# Altium project AMC_FMC_Carrier v4.PrjPcb (part 1 of 17)
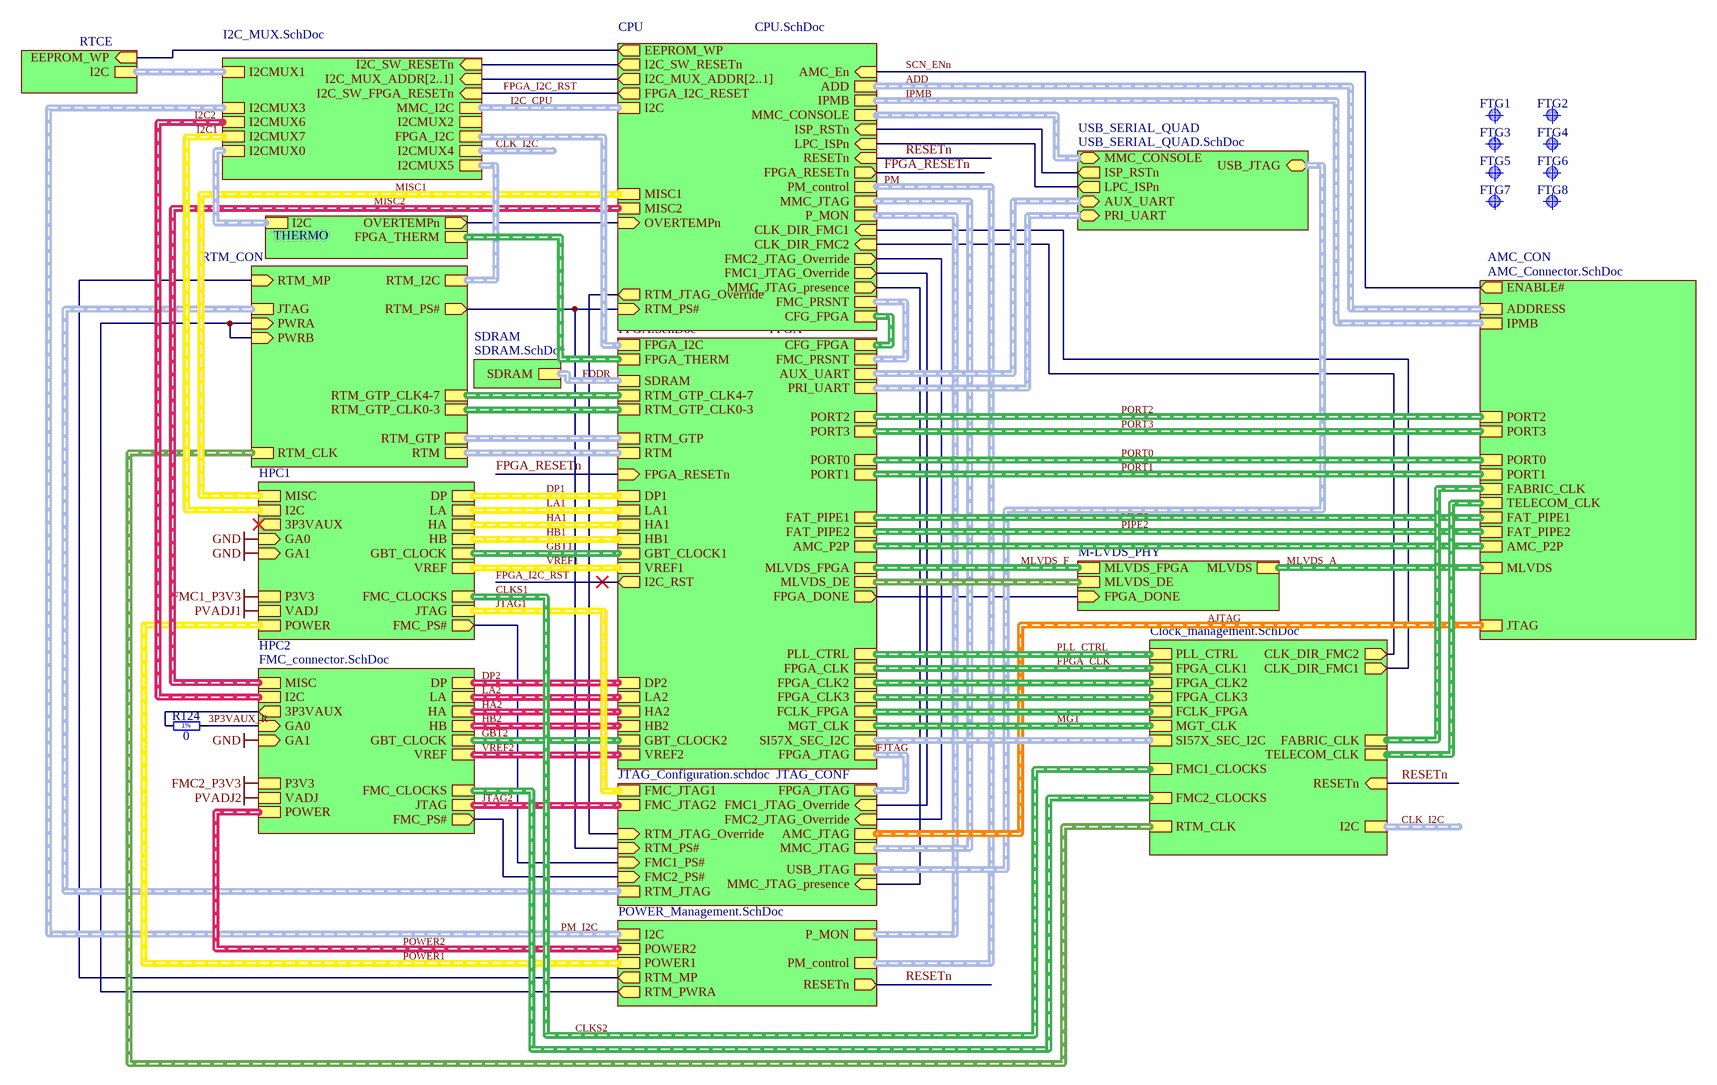
[diagram p0: AMC_FMC_Carrier.SchDoc]
=ModifiedBy: F.Świtakowski
28 sheets, 1702 parts. Net scope: hierarchical (ports join the sheet entries above them; power ports are global).
Board file: AMC_FMC_Carrier_v4.PcbDoc
Sheets:
  AMC_FMC_Carrier.SchDoc
    AMC_CON = AMC_Connector.SchDoc
    HPC1 = FMC_connector.SchDoc
    HPC2 = FMC_connector.SchDoc
    FPGA = FPGA.SchDoc
      FSDRAM = FPGA_SDRAM.SchDoc
      FHPC1 = FMC_HPC1.SchDoc
      FHPC2 = FMC_HPC2_RTM.SchDoc
      FMGT = FPGA_MGT.SchDoc
      FPGA_SUP = FPGA_SUP.SchDoc
    SDRAM = SDRAM.SchDoc
    PWR_MGT = POWER_Management.SchDoc
      SUP_HPC25 = SUP_2.5_FMC.SchDoc
      SUP_HPC33 = SUP_3.3_FMC.SchDoc
      SUP_15 = SUP_1.5_3.3.SchDoc
      SUP_12_18 = SUP_1.2_1.8.SchDoc
      SUP_10 = SUP_1V.SchDoc
      UI = UI_mon.SchDoc
    JTAG_CONF = JTAG_Configuration.SchDoc
    RTM_CON = RTM_CON.SchDoc
    M-LVDS_PHY = M-LVDS PHY.SchDoc
    CLK_MGT = Clock_management.SchDoc
      Oscillators = Oscillators.SchDoc
      Designator = 8V54816A_SUPPLY.SchDoc
    USB_SERIAL_QUAD = USB_SERIAL_QUAD.SchDoc
    I2C_MUX = I2C_MUX.SchDoc
    THERMO = Thermometers.SchDoc
    RTCE = RTCE.SchDoc
    CPU = CPU.SchDoc

## Sheet AMC_FMC_Carrier.SchDoc: AMC FMC Carrier v4
size 420 x 297 mm; Organization: WUT ISE; Address1: Warsaw University of Technology; Address2: Nowowiejska 15/19 00-665 Warsaw; Address3: t.przywozki@gmail.com; DocumentNumber: 1; Revision: 1; SheetNumber: 1; SheetTotal: 29; Project: AMC_FMC_Carrier v4.0.2; ModifiedBy: M. Biernat; CreateDate: XX/XX/XXXX; CheckedDate: -; Title2: Top; DivGrp: ISE; Designer: T.Przywozki

### Parts
FTG1  Use only in PCB  [FIDUCIAL_TOP_S100-200]  (value not drawn)  (no BOM)
FTG2  Use only in PCB  [FIDUCIAL_TOP_C100-200]  (value not drawn)  (no BOM)
FTG3  Use only in PCB  [FIDUCIAL_TOP_S100-200]  (value not drawn)  (no BOM)
FTG4  Use only in PCB  [FIDUCIAL_TOP_C100-200]  (value not drawn)  (no BOM)
FTG5  Use only in PCB  [FIDUCIAL_TOP_S100-200]  (value not drawn)  (no BOM)
FTG6  Use only in PCB  [FIDUCIAL_TOP_C100-200]  (value not drawn)  (no BOM)
FTG7  Use only in PCB  [FIDUCIAL_TOP_S100-200]  (value not drawn)  (no BOM)
FTG8  Use only in PCB  [FIDUCIAL_TOP_C100-200]  (value not drawn)  (no BOM)
R124  0  [RESC1005X40N]

### Sub-sheets
AMC_CON = AMC_Connector.SchDoc: JTAG (harness AMC_JTAG), TELECOM_CLK (harness AMC_TELECOM_CLOCK), ADDRESS (harness AMC_ADD), FABRIC_CLK (harness AMC_FABRIC_CLOCK), IPMB (harness I2C), ENABLE# (out), PORT0 (harness PORT0), PORT1 (harness PORT1), PORT2 (harness PORT2), PORT3 (harness PORT3), FAT_PIPE1 (harness FAT_PIPE1), FAT_PIPE2 (harness FAT_PIPE2), MLVDS (harness MLVDS), AMC_P2P (harness AMC_P2P)
CLK_MGT = Clock_management.SchDoc: FABRIC_CLK (harness AMC_FABRIC_CLOCK), TELECOM_CLK (harness AMC_TELECOM_CLOCK), FMC1_CLOCKS (harness FMC_CLOCKS), FMC2_CLOCKS (harness FMC_CLOCKS), MGT_CLK (harness MGT_CLK), FPGA_CLK1 (harness FPGA_SDRAM_CLK), PLL_CTRL (harness PLL_CTRL), RESETn (in), I2C (harness I2C), SI57X_SEC_I2C (harness SI57X_SEC_I2C), RTM_CLK (harness RTM_CLK), FPGA_CLK2 (harness FPGA_CLK), FPGA_CLK3 (harness FPGA_CLK), CLK_DIR_FMC2 (out), CLK_DIR_FMC1 (out), FCLK_FPGA (harness FPGA_CLK)
CPU = CPU.SchDoc: AMC_En (in), PM_control (harness PM_control), OVERTEMPn (in), CFG_FPGA (harness FPGA_CFG), RESETn (in), I2C (harness I2C), IPMB (harness I2C), MISC1 (harness MISC), MISC2 (harness MISC), ADD (harness AMC_ADD), FPGA_RESETn (out), RTM_PS# (in), I2C_SW_RESETn (out), RTM_JTAG_Override (out), FMC1_JTAG_Override (out), FMC2_JTAG_Override (out), MMC_JTAG (harness JTAG), ISP_RSTn (in), LPC_ISPn (in), MMC_CONSOLE (harness UART), I2C_MUX_ADDR[2..1] (out), P_MON (harness P_MON), EEPROM_WP (out), FMC_PRSNT (harness FMC_PRSNT), FPGA_I2C_RESET (out), CLK_DIR_FMC2 (in), CLK_DIR_FMC1 (in), MMC_JTAG_presence (out)
FPGA = FPGA.SchDoc: SDRAM (harness DDR), FPGA_JTAG (harness JTAG), VREF2 (harness FMC_J1_VREF), VREF1 (harness FMC_J1_VREF), FPGA_THERM (harness FPGA_THERM), CFG_FPGA (harness FPGA_CFG), FAT_PIPE1, FAT_PIPE2, PORT1 (harness PORT1), PORT0 (harness PORT0), MLVDS_FPGA (harness MLVDS-FPGA), GBT_CLOCK1, GBT_CLOCK2, MGT_CLK, FPGA_CLK, PLL_CTRL (harness PLL_CTRL), FPGA_RESETn (in), LA1, HA1, HB1, LA2, HA2, HB2, DP1, DP2, PORT2 (harness PORT2), PORT3 (harness PORT3), RTM_GTP (harness RTM_GTP), RTM_GTP_CLK4-7 (harness CLK_DIFF), RTM_GTP_CLK0-3 (harness CLK_DIFF), AMC_P2P (harness AMC_P2P), FPGA_I2C (harness I2C), SI57X_SEC_I2C (harness SI57X_SEC_I2C), PRI_UART (harness UART), RTM (harness RTM), I2C_RST (out), AUX_UART (harness UART), FPGA_DONE (out), FPGA_CLK2 (harness FPGA_CLK), FPGA_CLK3 (harness FPGA_CLK), FMC_PRSNT (harness FMC_PRSNT), MLVDS_DE (harness MLVDS_DE), FCLK_FPGA (harness FPGA_CLK)
HPC1 = FMC_connector.SchDoc: DP (harness FMC_J1_DP), LA (harness FMC_J1_LA), HA (harness FMC_J1_HA), HB (harness FMC_J1_HB), MISC (harness MISC), POWER (harness FMC_J1_POWER), JTAG (harness JTAG), I2C (harness I2C), GA0 (in), GA1 (in), 3P3VAUX (out), VREF (harness FMC_J1_VREF), FMC_CLOCKS (harness FMC_CLOCKS), GBT_CLOCK (harness GBT_CLOCK), VADJ, P3V3, FMC_PS# (out)
HPC2 = FMC_connector.SchDoc: DP (harness FMC_J1_DP), LA (harness FMC_J1_LA), HA (harness FMC_J1_HA), HB (harness FMC_J1_HB), MISC (harness MISC), POWER (harness FMC_J1_POWER), JTAG (harness JTAG), I2C (harness I2C), VREF (harness FMC_J1_VREF), GA0 (in), GA1 (in), 3P3VAUX (out), FMC_CLOCKS (harness FMC_CLOCKS), GBT_CLOCK (harness GBT_CLOCK), VADJ, P3V3, FMC_PS# (out)
I2C_MUX = I2C_MUX.SchDoc: I2CMUX0 (harness I2C), I2CMUX1 (harness I2C), I2CMUX3 (harness I2C), I2CMUX4 (harness I2C), I2C_SW_RESETn (in), MMC_I2C (harness I2C), I2CMUX7 (harness I2C), I2CMUX6 (harness I2C), I2CMUX5 (harness I2C), FPGA_I2C (harness I2C), I2C_MUX_ADDR[2..1] (in), I2C_SW_FPGA_RESETn (in), I2CMUX2 (harness I2C)
JTAG_CONF = JTAG_Configuration.schdoc: FMC_JTAG1 (harness JTAG), FMC_JTAG2 (harness JTAG), AMC_JTAG (harness AMC_JTAG), FPGA_JTAG (harness JTAG), RTM_JTAG (harness JTAG), FMC1_PS# (in), FMC2_PS# (in), MMC_JTAG (harness JTAG), USB_JTAG (harness USB_JTAG), RTM_PS# (in), RTM_JTAG_Override (in), FMC2_JTAG_Override (in), FMC1_JTAG_Override (in), MMC_JTAG_presence (in)
M-LVDS_PHY = M-LVDS PHY.SchDoc: MLVDS (harness MLVDS), MLVDS_FPGA (harness MLVDS-FPGA), FPGA_DONE (in), MLVDS_DE (harness MLVDS_DE)
PWR_MGT = POWER_Management.SchDoc: POWER1 (harness FMC_J1_POWER), POWER2 (harness FMC_J1_POWER), PM_control (harness PM_control), RESETn (out), I2C (harness I2C), RTM_MP (out), RTM_PWRA (out), P_MON (harness P_MON)
RTCE = RTCE.SchDoc: I2C (harness I2C), EEPROM_WP (in)
RTM_CON = RTM_CON.SchDoc: PWRA (in), PWRB (in), RTM_PS# (out), RTM_MP (in), RTM_GTP (harness RTM_GTP), JTAG (harness JTAG), RTM_GTP_CLK4-7 (harness CLK_DIFF), RTM_GTP_CLK0-3 (harness CLK_DIFF), RTM_CLK (harness RTM_CLK), RTM (harness RTM), RTM_I2C (harness I2C)
SDRAM = SDRAM.SchDoc: SDRAM (harness DDR)
THERMO = Thermometers.SchDoc: OVERTEMPn (out), FPGA_THERM (harness FPGA_THERM), I2C (harness I2C)
USB_SERIAL_QUAD = USB_SERIAL_QUAD.SchDoc: PRI_UART (bidir, harness UART), AUX_UART (bidir, harness UART), ISP_RSTn (out), LPC_ISPn (out), MMC_CONSOLE (bidir, harness UART), USB_JTAG (bidir, harness USB_JTAG)

### Nets
FMC2_3P3VAUX: R124.1 ; sheet HPC2/3P3VAUX
GND: sheet HPC1/GA0, sheet HPC1/GA1, sheet HPC2/GA1
3P3VAUX_R: R124.2 ; sheet HPC2/GA0
CLK_DIR: sheet CLK_MGT/CLK_DIR_FMC2, sheet CPU/CLK_DIR_FMC2
CLKS1.CLK_DIR: sheet CLK_MGT/CLK_DIR_FMC1, sheet CPU/CLK_DIR_FMC1
DONE: sheet FPGA/FPGA_DONE, sheet M-LVDS_PHY/FPGA_DONE
DTR: sheet USB_SERIAL_QUAD/ISP_RSTn, sheet CPU/ISP_RSTn
EEPROM_WP: sheet RTCE/EEPROM_WP, sheet CPU/EEPROM_WP
FMC1_JTAG_Override: sheet JTAG_CONF/FMC1_JTAG_Override, sheet CPU/FMC1_JTAG_Override
FMC2_JTAG_Override: sheet JTAG_CONF/FMC2_JTAG_Override, sheet CPU/FMC2_JTAG_Override
FMC_PRSNT.FMC1_PRSNT_M2C_L: sheet HPC1/FMC_PS#, sheet JTAG_CONF/FMC1_PS#
FMC_PRSNT.FMC2_PRSNT_M2C_L: sheet HPC2/FMC_PS#, sheet JTAG_CONF/FMC2_PS#
FPGA_I2C_RST: sheet FPGA/I2C_RST, sheet I2C_MUX/I2C_SW_FPGA_RESETn, sheet CPU/FPGA_I2C_RESET
FPGA_RESETn: sheet FPGA/FPGA_RESETn, sheet CPU/FPGA_RESETn
I2C_SW_RESETn: sheet I2C_MUX/I2C_SW_RESETn, sheet CPU/I2C_SW_RESETn
LPC_ISPn: sheet USB_SERIAL_QUAD/LPC_ISPn, sheet CPU/LPC_ISPn
MMC_JTAG_presence: sheet JTAG_CONF/MMC_JTAG_presence, sheet CPU/MMC_JTAG_presence
OVERTEMPn: sheet THERMO/OVERTEMPn, sheet CPU/OVERTEMPn
PWRA: sheet PWR_MGT/RTM_PWRA, sheet RTM_CON/PWRA, sheet RTM_CON/PWRB
RESETn: sheet PWR_MGT/RESETn, sheet CLK_MGT/RESETn, sheet CPU/RESETn
RTM_JTAG_Override: sheet JTAG_CONF/RTM_JTAG_Override, sheet CPU/RTM_JTAG_Override
RTM_MP: sheet PWR_MGT/RTM_MP, sheet RTM_CON/RTM_MP
RTM_PS#: sheet JTAG_CONF/RTM_PS#, sheet RTM_CON/RTM_PS#, sheet CPU/RTM_PS#
SCN_ENn: sheet AMC_CON/ENABLE#, sheet CPU/AMC_En

### Buses and harness runs
bus sheet CPU/I2C_MUX_ADDR[2..1] = sheet I2C_MUX/I2C_MUX_ADDR[2..1]
harness ADD = sheet AMC_CON/ADDRESS = sheet CPU/ADD
harness AJTAG = sheet AMC_CON/JTAG = sheet JTAG_CONF/AMC_JTAG
harness CLK_I2C = sheet CLK_MGT/I2C
harness CLK_I2C = sheet I2C_MUX/I2CMUX4
harness CLKS1 = CLKS2 = sheet CLK_MGT/FMC1_CLOCKS = sheet HPC1/FMC_CLOCKS
harness DP1 = sheet FPGA/DP1 = sheet HPC1/DP
harness DP2 = sheet FPGA/DP2 = sheet HPC2/DP
harness FDDR = sheet FPGA/SDRAM = sheet SDRAM/SDRAM
harness FJTAG = sheet FPGA/FPGA_JTAG = sheet JTAG_CONF/FPGA_JTAG
harness FPGA_CLK = sheet CLK_MGT/FPGA_CLK1 = sheet FPGA/FPGA_CLK
harness GBT1 = sheet FPGA/GBT_CLOCK1 = sheet HPC1/GBT_CLOCK
harness GBT2 = sheet FPGA/GBT_CLOCK2 = sheet HPC2/GBT_CLOCK
harness HA1 = sheet FPGA/HA1 = sheet HPC1/HA
harness HA2 = sheet FPGA/HA2 = sheet HPC2/HA
harness HB1 = sheet FPGA/HB1 = sheet HPC1/HB
harness HB2 = sheet FPGA/HB2 = sheet HPC2/HB
harness I2C1 = sheet HPC1/I2C = sheet I2C_MUX/I2CMUX7
harness I2C2 = sheet HPC2/I2C = sheet I2C_MUX/I2CMUX6
harness I2C_CPU = sheet CPU/I2C = sheet I2C_MUX/MMC_I2C
harness IPMB = sheet AMC_CON/IPMB = sheet CPU/IPMB
harness JTAG1 = sheet HPC1/JTAG = sheet JTAG_CONF/FMC_JTAG1
harness JTAG2 = sheet HPC2/JTAG = sheet JTAG_CONF/FMC_JTAG2
harness LA1 = sheet FPGA/LA1 = sheet HPC1/LA
harness LA2 = sheet FPGA/LA2 = sheet HPC2/LA
harness MGT = sheet CLK_MGT/MGT_CLK = sheet FPGA/MGT_CLK
harness MISC1 = sheet CPU/MISC1 = sheet HPC1/MISC
harness MISC2 = sheet CPU/MISC2 = sheet HPC2/MISC
harness MLVDS_A = sheet AMC_CON/MLVDS = sheet M-LVDS_PHY/MLVDS
harness MLVDS_F = sheet FPGA/MLVDS_FPGA = sheet M-LVDS_PHY/MLVDS_FPGA
harness PIPE1 = sheet AMC_CON/FAT_PIPE1 = sheet FPGA/FAT_PIPE1
harness PIPE2 = sheet AMC_CON/FAT_PIPE2 = sheet FPGA/FAT_PIPE2
harness PLL_CTRL = sheet CLK_MGT/PLL_CTRL = sheet FPGA/PLL_CTRL
harness PM = sheet CPU/PM_control = sheet PWR_MGT/PM_control
harness PM_I2C = sheet I2C_MUX/I2CMUX3 = sheet PWR_MGT/I2C
harness PORT0 = sheet AMC_CON/PORT0 = sheet FPGA/PORT0
harness PORT1 = sheet AMC_CON/PORT1 = sheet FPGA/PORT1
harness PORT2 = sheet AMC_CON/PORT2 = sheet FPGA/PORT2
harness PORT3 = sheet AMC_CON/PORT3 = sheet FPGA/PORT3
harness POWER1 = sheet HPC1/POWER = sheet PWR_MGT/POWER1
harness POWER2 = sheet HPC2/POWER = sheet PWR_MGT/POWER2
harness sheet AMC_CON/AMC_P2P = sheet FPGA/AMC_P2P
harness sheet AMC_CON/FABRIC_CLK = sheet CLK_MGT/FABRIC_CLK
harness sheet AMC_CON/TELECOM_CLK = sheet CLK_MGT/TELECOM_CLK
harness sheet CLK_MGT/FCLK_FPGA = sheet FPGA/FCLK_FPGA
harness sheet CLK_MGT/FMC2_CLOCKS = sheet HPC2/FMC_CLOCKS
harness sheet CLK_MGT/FPGA_CLK2 = sheet FPGA/FPGA_CLK2
harness sheet CLK_MGT/FPGA_CLK3 = sheet FPGA/FPGA_CLK3
harness sheet CLK_MGT/RTM_CLK = sheet RTM_CON/RTM_CLK
harness sheet CLK_MGT/SI57X_SEC_I2C = sheet FPGA/SI57X_SEC_I2C
harness sheet CPU/CFG_FPGA = sheet FPGA/CFG_FPGA
harness sheet CPU/FMC_PRSNT = sheet FPGA/FMC_PRSNT
harness sheet CPU/MMC_CONSOLE = sheet USB_SERIAL_QUAD/MMC_CONSOLE
harness sheet CPU/MMC_JTAG = sheet JTAG_CONF/MMC_JTAG
harness sheet CPU/P_MON = sheet PWR_MGT/P_MON
harness sheet FPGA/AUX_UART = sheet USB_SERIAL_QUAD/AUX_UART
harness sheet FPGA/FPGA_I2C = sheet I2C_MUX/FPGA_I2C
harness sheet FPGA/FPGA_THERM = sheet THERMO/FPGA_THERM
harness sheet FPGA/MLVDS_DE = sheet M-LVDS_PHY/MLVDS_DE
harness sheet FPGA/PRI_UART = sheet USB_SERIAL_QUAD/PRI_UART
harness sheet FPGA/RTM = sheet RTM_CON/RTM
harness sheet FPGA/RTM_GTP = sheet RTM_CON/RTM_GTP
harness sheet FPGA/RTM_GTP_CLK0-3 = sheet RTM_CON/RTM_GTP_CLK0-3
harness sheet FPGA/RTM_GTP_CLK4-7 = sheet RTM_CON/RTM_GTP_CLK4-7
harness sheet I2C_MUX/I2CMUX0 = sheet THERMO/I2C
harness sheet I2C_MUX/I2CMUX1 = sheet RTCE/I2C
harness sheet I2C_MUX/I2CMUX5 = sheet RTM_CON/RTM_I2C
harness sheet JTAG_CONF/RTM_JTAG = sheet RTM_CON/JTAG
harness sheet JTAG_CONF/USB_JTAG = sheet USB_SERIAL_QUAD/USB_JTAG
harness VREF1 = sheet FPGA/VREF1 = sheet HPC1/VREF
harness VREF2 = sheet FPGA/VREF2 = sheet HPC2/VREF

### Notes on the sheet
- Project/Equipment
- Document
- Designer
- Drawn by
- Check.by
- Copyright CNPEM 2013, WUT ISE 2020
  This documentation describes Open Hardware and is licensed under CERN OHL v.1.1. You may redistribute and modify this documentaction under the terms of the CERN OHL v1.1.
  (http://ohwr.org/CERNOHL). This documentation is dristributed WITHOUT ANY EXPRESS OR IMPLIED WARRANTY, INCLUDING OF MERCHANTABLITY, SATISFACTORY QUALITY AND FITNESS FOR A PARTICULAR PURPOSE. Please see the CERN OHL v.1.1 for applicable conditions
- File
- Last Mod.
- Print Date
- Sheet
- Size
- A3
- of
- Rev
- Contact:
- (in symbol R0402_0R_JUMPER) 1%

### Library data of the parts
FTG1 FTG3 FTG5 FTG7 = FIDUCIAL_TARGET_S100-200: Fiducial Target; Part Description: Square Fiducial Target, Top Layer, 1.0mm, Top Solder 2.0mm, Keepout =2.0mm; Mounted: No; Table: Pads; Part Number: FIDUCIAL_TARGET_S100-200; Component Type: Standard (No BOM); Pin Count: 1; Family: Fiducial; Socket: No; SMD: Yes; Status: None; ComponentHeight: 0mm; Author: CERN DEM JLC; CreateDate: 2010-02-09; LatestRevisionDate: 2012-04-04; PackageDescription: Square Fiducial Target, Top Layer, 1.0mm, Top Solder 2.0mm, Keepout =2.0mm
FTG2 FTG4 FTG6 FTG8 = FIDUCIAL_TARGET_C100-200: Fiducial Target; Part Description: Round Fiducial Target, Top Layer, 1.0mm, Top Solder 2.0mm, Keepout =2.0mm; Mounted: No; Table: Pads; Part Number: FIDUCIAL_TARGET_C100-200; Component Type: Standard (No BOM); Pin Count: 1; Family: Fiducial; Socket: No; SMD: Yes; Status: None; ComponentHeight: 0mm; Author: CERN DEM JLC; CreateDate: 2010-02-09; LatestRevisionDate: 2012-04-04; PackageDescription: Round Fiducial Target, Top Layer, 1.0mm, Top Solder 2.0mm, Keepout =2.0mm
R124 = R0402_0R_JUMPER: Resistor - 1%; Part Description: 1A (0.05R Max DC Resistance) Zero Ohm Jumper; Manufacturer: GENERIC; Manufacturer1 Part Number: 232270591001L; Table: Resistors SMD; Part Number: R0402_0R_JUMPER; Component Kind: Standard; Component Type: Standard; Pin Count: 2; Value: 0; Status: Not recommended; Manufacturer Part Number: R0402_0R_JUMPER; Case: 0402; Mounted: Yes; Socket: No; SMD: Yes; Manufacturer1 Example: YAGEO PHYCOMP; Manufacturer1 ComponentHeight: 0.4mm; HelpURL: \\cern.ch\dfs\Applications\Altium\Datasheets\R0402_Phycomp_RC0402.pdf; Author: CERN DEM JLC; CreateDate: 2007-12-03; LatestRevisionDate: 2012-10-17

## Sheet AMC_Connector.SchDoc: AMC FMC Carrier v4.0.5
size 420 x 297 mm; DocumentNumber: 1; Revision: 1; SheetNumber: 2; SheetTotal: 29; Organization: ISE; Address1: Warsaw University of Technology; Address2: Nowowiejska 15/19 00-665 Warsaw; Address3: t.przywozki@gmail.com; ModifiedBy: F. Świtakowski; CheckedDate: -; Title2: AMC connector; DivGrp: ISE; Designer: T.Przywozki; Project: AMC FMC Carrier v4.0.5
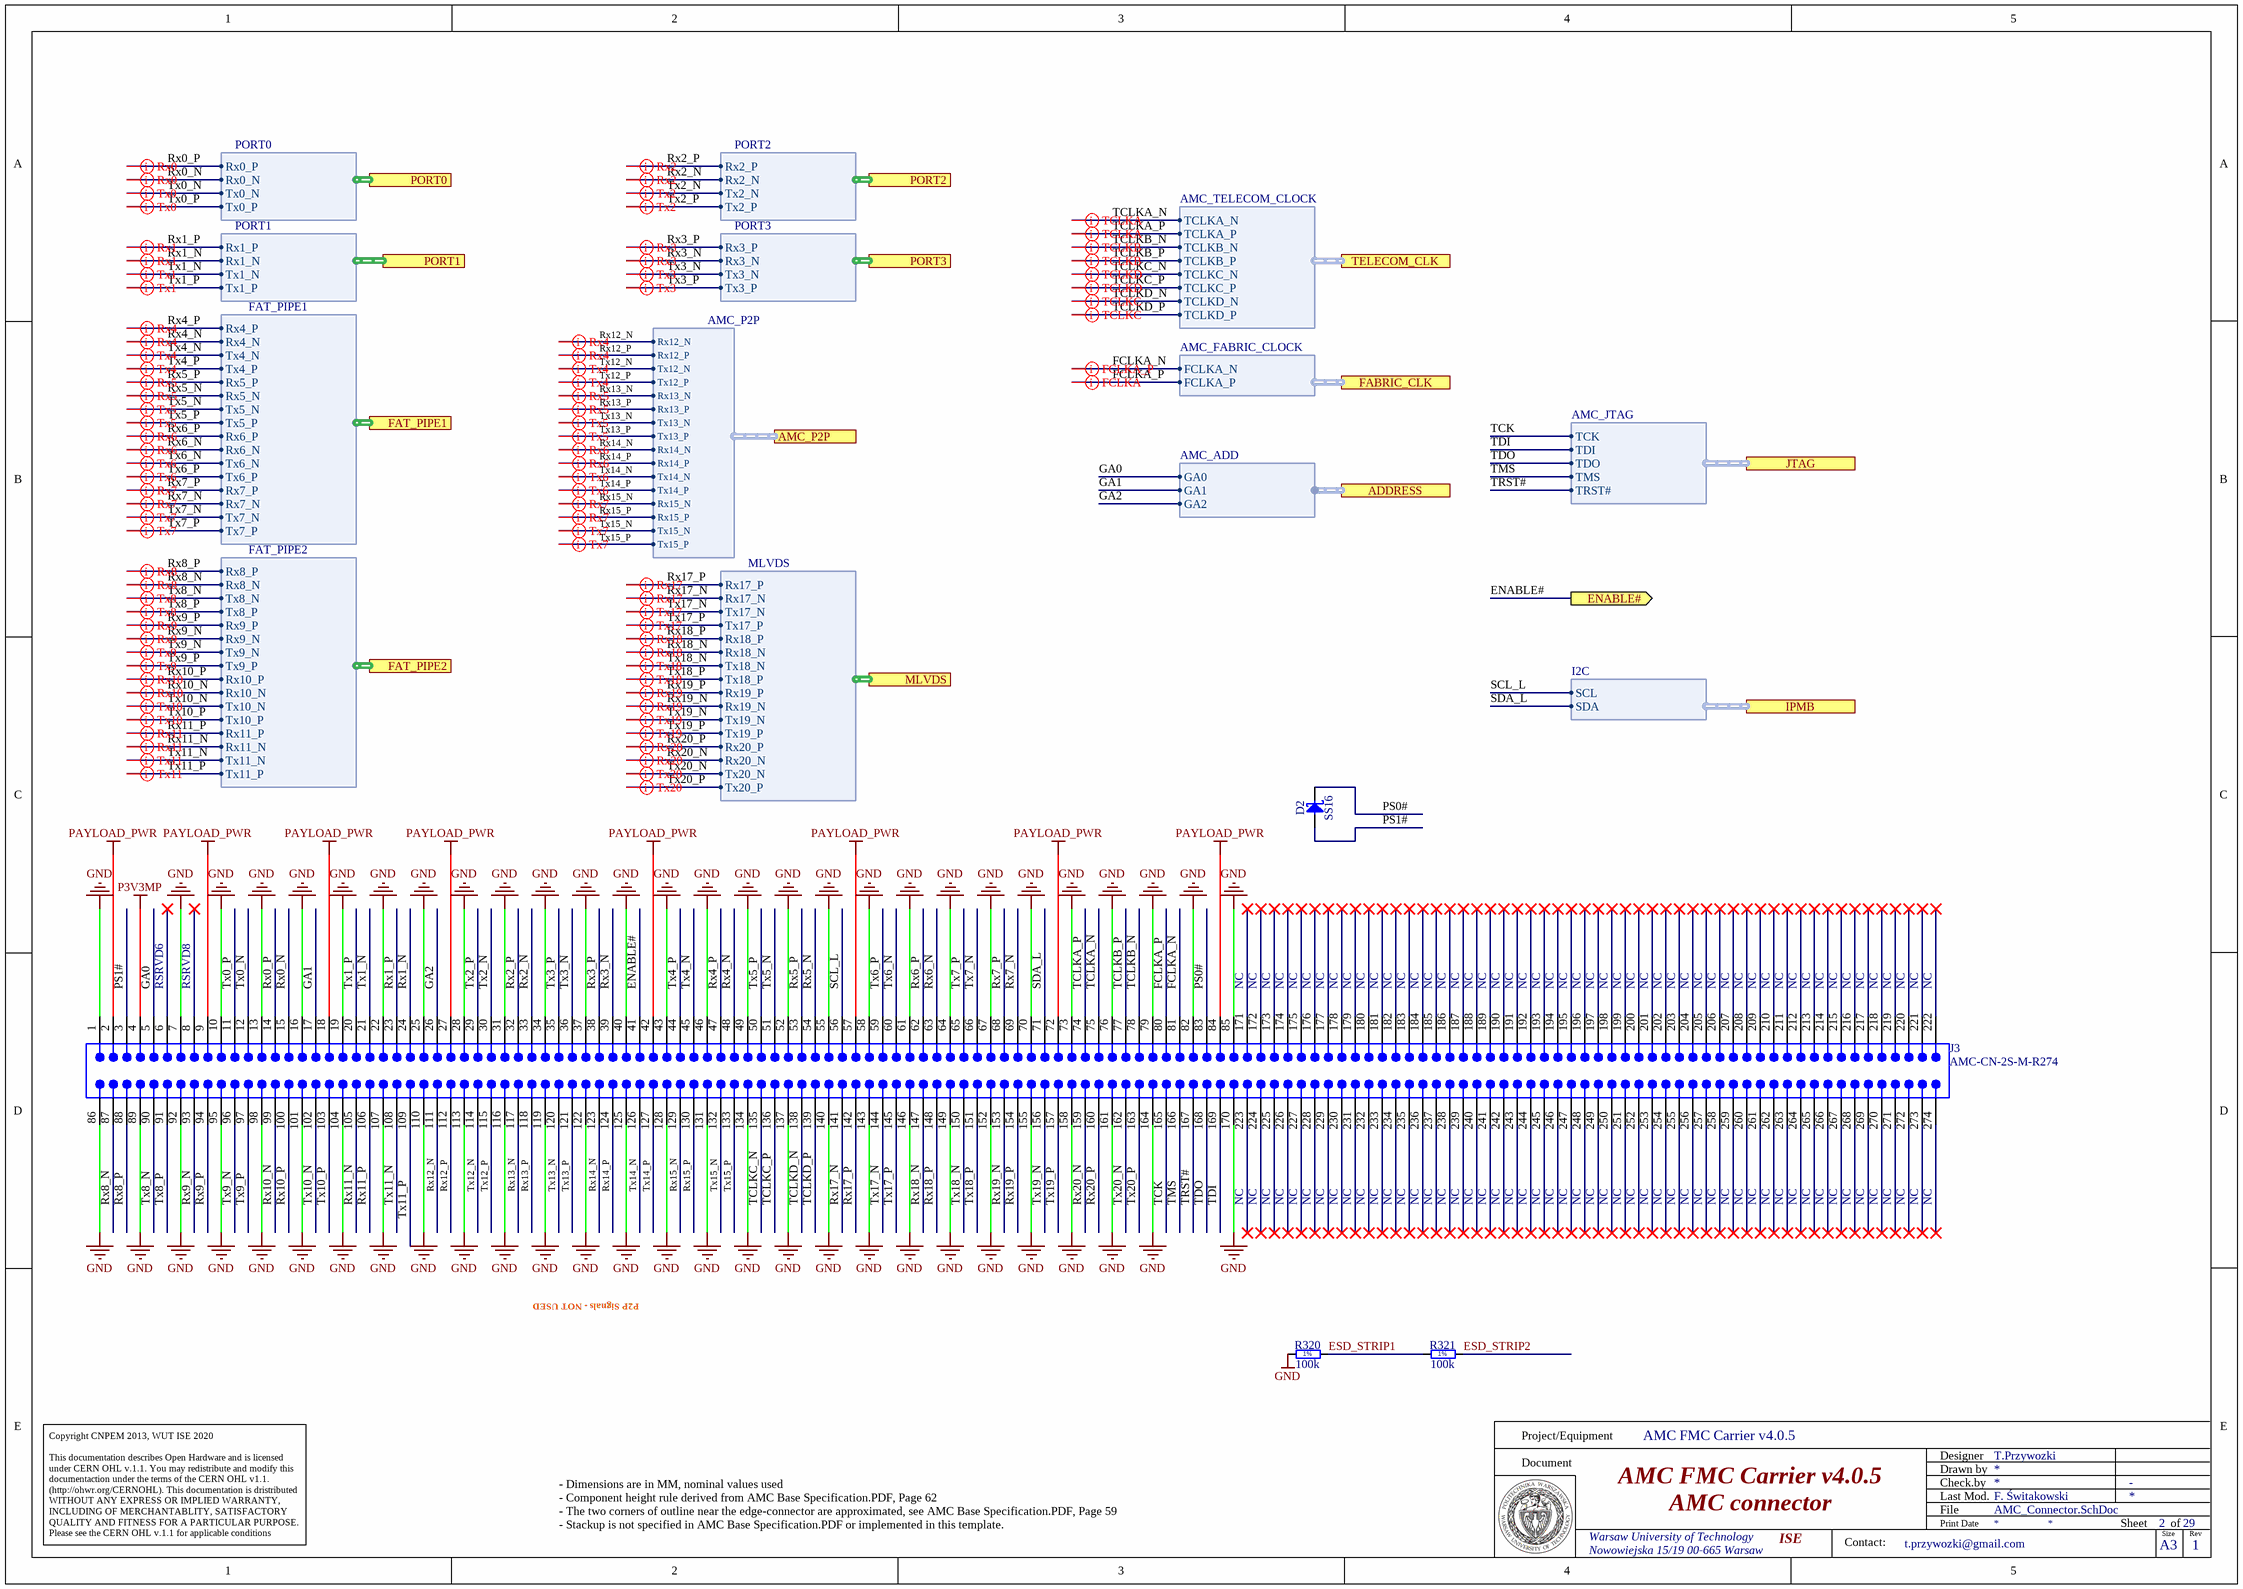
[diagram p1: AMC_Connector.SchDoc]

### Parts
D2  SS16  [DIOM5127X229N]
J3  AMC-CN-2S-M-R274  [AMC-GF-2D-750-O274]  (no BOM)
R320  100k  [RESC3216X65N]
R321  100k  [RESC3216X65N]

### Ports
ADDRESS (harness AMC_ADD), AMC_P2P (harness AMC_P2P), ENABLE# (out), FABRIC_CLK (harness AMC_FABRIC_CLOCK), FAT_PIPE1 (harness FAT_PIPE1), FAT_PIPE2 (harness FAT_PIPE2), IPMB (harness I2C), JTAG (harness AMC_JTAG), MLVDS (harness MLVDS), PORT0 (harness PORT0), PORT1 (harness PORT1), PORT2 (harness PORT2), PORT3 (harness PORT3), TELECOM_CLK (harness AMC_TELECOM_CLOCK)

### Harnesses
AMC_JTAG: TCK, TDI, TDO, TMS, TRST#
AMC_TELECOM_CLOCK: TCLKA_N, TCLKA_P, TCLKB_N, TCLKB_P, TCLKC_N, TCLKC_P, TCLKD_N, TCLKD_P
AMC_FABRIC_CLOCK: FCLKA_N, FCLKA_P
I2C: SCL, SDA
PORT0: Rx0_P, Rx0_N, Tx0_N, Tx0_P
PORT1: Rx1_P, Rx1_N, Tx1_N, Tx1_P
FAT_PIPE1: Rx4_P, Rx4_N, Tx4_N, Tx4_P, Rx5_P, Rx5_N, Tx5_N, Tx5_P, Rx6_P, Rx6_N, Tx6_N, Tx6_P, Rx7_P, Rx7_N, Tx7_N, Tx7_P
FAT_PIPE2: Rx8_P, Rx8_N, Tx8_N, Tx8_P, Rx9_P, Rx9_N, Tx9_N, Tx9_P, Rx10_P, Rx10_N, Tx10_N, Tx10_P, Rx11_P, Rx11_N, Tx11_N, Tx11_P
MLVDS: Rx17_P, Rx17_N, Tx17_N, Tx17_P, Rx18_P, Rx18_N, Tx18_N, Tx18_P, Rx19_P, Rx19_N, Tx19_N, Tx19_P, Rx20_P, Rx20_N, Tx20_N, Tx20_P
PORT2: Rx2_P, Rx2_N, Tx2_N, Tx2_P
PORT3: Rx3_P, Rx3_N, Tx3_N, Tx3_P
AMC_ADD: GA0, GA1, GA2
AMC_P2P: Rx12_N, Rx12_P, Tx12_N, Tx12_P, Rx13_N, Rx13_P, Tx13_N, Tx13_P, Rx14_N, Rx14_P, Tx14_N, Tx14_P, Rx15_N, Rx15_P, Tx15_N, Tx15_P

### Nets
GND: J3.1 J3.7 J3.10 J3.13 J3.16 J3.19 J3.22 J3.25 J3.28 J3.31 J3.34 J3.37 J3.40 J3.43 J3.46 J3.49 J3.52 J3.55 J3.58 J3.61 J3.64 J3.67 J3.70 J3.73 J3.76 J3.79 J3.82 J3.85 J3.86 J3.89 J3.92 J3.95 J3.98 J3.101 J3.104 J3.107 J3.110 J3.113 J3.116 J3.119 J3.122 J3.125 J3.128 J3.131 J3.134 J3.137 J3.140 J3.143 J3.146 J3.149 J3.152 J3.155 J3.158 J3.161 J3.164 J3.170 R320.1
P3V3MP: J3.4
PAYLOAD_PWR: J3.2 J3.9 J3.18 J3.27 J3.42 J3.57 J3.72 J3.84
ENABLE#: J3.41 ; port ENABLE#  [project net SCN_ENn]
ESD_STRIP1: R320.2 R321.1
ESD_STRIP2: R321.2
FCLKA_N: J3.81 ; port FABRIC_CLK.FCLKA_N  [project net MGT.FCLK_GTP216_CLK0_N]
FCLKA_P: J3.80 ; port FABRIC_CLK.FCLKA_P  [project net MGT.FCLK_GTP216_CLK0_P]
GA0: J3.5 ; port ADDRESS.GA0  [project net ADD.GA0]
GA1: J3.17 ; port ADDRESS.GA1  [project net ADD.GA1]
GA2: J3.26 ; port ADDRESS.GA2  [project net ADD.GA2]
PS0#: D2.1(C) J3.83
PS1#: D2.2(A) J3.3
Rx0_N: J3.15 ; port PORT0.Rx0_N  [project net PORT0.Rx0_N]
Rx0_P: J3.14 ; port PORT0.Rx0_P  [project net PORT0.Rx0_P]
Rx1_N: J3.24 ; port PORT1.Rx1_N  [project net PORT1.Rx1_N]
Rx1_P: J3.23 ; port PORT1.Rx1_P  [project net PORT1.Rx1_P]
Rx2_N: J3.33 ; port PORT2.Rx2_N  [project net PORT2.Rx2_N]
Rx2_P: J3.32 ; port PORT2.Rx2_P  [project net PORT2.Rx2_P]
Rx3_N: J3.39 ; port PORT3.Rx3_N  [project net PORT3.Rx3_N]
Rx3_P: J3.38 ; port PORT3.Rx3_P  [project net PORT3.Rx3_P]
Rx4_N: J3.48 ; port FAT_PIPE1.Rx4_N  [project net PIPE1.Rx4_N]
Rx4_P: J3.47 ; port FAT_PIPE1.Rx4_P  [project net PIPE1.Rx4_P]
Rx5_N: J3.54 ; port FAT_PIPE1.Rx5_N  [project net PIPE1.Rx5_N]
Rx5_P: J3.53 ; port FAT_PIPE1.Rx5_P  [project net PIPE1.Rx5_P]
Rx6_N: J3.63 ; port FAT_PIPE1.Rx6_N  [project net PIPE1.Rx6_N]
Rx6_P: J3.62 ; port FAT_PIPE1.Rx6_P  [project net PIPE1.Rx6_P]
Rx7_N: J3.69 ; port FAT_PIPE1.Rx7_N  [project net PIPE1.Rx7_N]
Rx7_P: J3.68 ; port FAT_PIPE1.Rx7_P  [project net PIPE1.Rx7_P]
Rx8_N: J3.87 ; port FAT_PIPE2.Rx8_N  [project net PIPE2.Rx8_N]
Rx8_P: J3.88 ; port FAT_PIPE2.Rx8_P  [project net PIPE2.Rx8_P]
Rx9_N: J3.93 ; port FAT_PIPE2.Rx9_N  [project net PIPE2.Rx9_N]
Rx9_P: J3.94 ; port FAT_PIPE2.Rx9_P  [project net PIPE2.Rx9_P]
Rx10_N: J3.99 ; port FAT_PIPE2.Rx10_N  [project net PIPE2.Rx10_N]
Rx10_P: J3.100 ; port FAT_PIPE2.Rx10_P  [project net PIPE2.Rx10_P]
Rx11_N: J3.105 ; port FAT_PIPE2.Rx11_N  [project net PIPE2.Rx11_N]
Rx11_P: J3.106 ; port FAT_PIPE2.Rx11_P  [project net PIPE2.Rx11_P]
Rx12_N: J3.111 ; port AMC_P2P.Rx12_N
Rx12_P: J3.112 ; port AMC_P2P.Rx12_P
Rx13_N: J3.117 ; port AMC_P2P.Rx13_N
Rx13_P: J3.118 ; port AMC_P2P.Rx13_P
Rx14_N: J3.123 ; port AMC_P2P.Rx14_N
Rx14_P: J3.124 ; port AMC_P2P.Rx14_P
Rx15_N: J3.129 ; port AMC_P2P.Rx15_N
Rx15_P: J3.130 ; port AMC_P2P.Rx15_P
Rx17_N: J3.141 ; port MLVDS.Rx17_N  [project net MLVDS_A.Rx17_N]
Rx17_P: J3.142 ; port MLVDS.Rx17_P  [project net MLVDS_A.Rx17_P]
Rx18_N: J3.147 ; port MLVDS.Rx18_N  [project net MLVDS_A.Rx18_N]
Rx18_P: J3.148 ; port MLVDS.Rx18_P  [project net MLVDS_A.Rx18_P]
Rx19_N: J3.153 ; port MLVDS.Rx19_N  [project net MLVDS_A.Rx19_N]
Rx19_P: J3.154 ; port MLVDS.Rx19_P  [project net MLVDS_A.Rx19_P]
Rx20_N: J3.159 ; port MLVDS.Rx20_N  [project net MLVDS_A.Rx20_N]
Rx20_P: J3.160 ; port MLVDS.Rx20_P  [project net MLVDS_A.Rx20_P]
SCL_L: J3.56 ; port IPMB.SCL  [project net IPMB.SCL]
SDA_L: J3.71 ; port IPMB.SDA  [project net IPMB.SDA]
TCK: J3.165 ; port JTAG.TCK  [project net AJTAG.TCK]
TCLKA_N: J3.75 ; port TELECOM_CLK.TCLKA_N
TCLKA_P: J3.74 ; port TELECOM_CLK.TCLKA_P
TCLKB_N: J3.78 ; port TELECOM_CLK.TCLKB_N
TCLKB_P: J3.77 ; port TELECOM_CLK.TCLKB_P
TCLKC_N: J3.135 ; port TELECOM_CLK.TCLKC_N
TCLKC_P: J3.136 ; port TELECOM_CLK.TCLKC_P
TCLKD_N: J3.138 ; port TELECOM_CLK.TCLKD_N
TCLKD_P: J3.139 ; port TELECOM_CLK.TCLKD_P
TDI: J3.169 ; port JTAG.TDI  [project net AJTAG.TDI]
TDO: J3.168 ; port JTAG.TDO  [project net AJTAG.TDO]
TMS: J3.166 ; port JTAG.TMS  [project net AJTAG.TMS]
TRST#: J3.167 ; port JTAG.TRST#  [project net AJTAG.TRST#]
Tx0_N: J3.12 ; port PORT0.Tx0_N  [project net PORT0.Tx0_N]
Tx0_P: J3.11 ; port PORT0.Tx0_P  [project net PORT0.Tx0_P]
Tx1_N: J3.21 ; port PORT1.Tx1_N  [project net PORT1.Tx1_N]
Tx1_P: J3.20 ; port PORT1.Tx1_P  [project net PORT1.Tx1_P]
Tx2_N: J3.30 ; port PORT2.Tx2_N  [project net PORT2.Tx2_N]
Tx2_P: J3.29 ; port PORT2.Tx2_P  [project net PORT2.Tx2_P]
Tx3_N: J3.36 ; port PORT3.Tx3_N  [project net PORT3.Tx3_N]
Tx3_P: J3.35 ; port PORT3.Tx3_P  [project net PORT3.Tx3_P]
Tx4_N: J3.45 ; port FAT_PIPE1.Tx4_N  [project net PIPE1.Tx4_N]
Tx4_P: J3.44 ; port FAT_PIPE1.Tx4_P  [project net PIPE1.Tx4_P]
Tx5_N: J3.51 ; port FAT_PIPE1.Tx5_N  [project net PIPE1.Tx5_N]
Tx5_P: J3.50 ; port FAT_PIPE1.Tx5_P  [project net PIPE1.Tx5_P]
Tx6_N: J3.60 ; port FAT_PIPE1.Tx6_N  [project net PIPE1.Tx6_N]
Tx6_P: J3.59 ; port FAT_PIPE1.Tx6_P  [project net PIPE1.Tx6_P]
Tx7_N: J3.66 ; port FAT_PIPE1.Tx7_N  [project net PIPE1.Tx7_N]
Tx7_P: J3.65 ; port FAT_PIPE1.Tx7_P  [project net PIPE1.Tx7_P]
Tx8_N: J3.90 ; port FAT_PIPE2.Tx8_N  [project net PIPE2.Tx8_N]
Tx8_P: J3.91 ; port FAT_PIPE2.Tx8_P  [project net PIPE2.Tx8_P]
Tx9_N: J3.96 ; port FAT_PIPE2.Tx9_N  [project net PIPE2.Tx9_N]
Tx9_P: J3.97 ; port FAT_PIPE2.Tx9_P  [project net PIPE2.Tx9_P]
Tx10_N: J3.102 ; port FAT_PIPE2.Tx10_N  [project net PIPE2.Tx10_N]
Tx10_P: J3.103 ; port FAT_PIPE2.Tx10_P  [project net PIPE2.Tx10_P]
Tx11_N: J3.108 ; port FAT_PIPE2.Tx11_N  [project net PIPE2.Tx11_N]
Tx11_P: J3.109 ; port FAT_PIPE2.Tx11_P  [project net PIPE2.Tx11_P]
Tx12_N: J3.114 ; port AMC_P2P.Tx12_N
Tx12_P: J3.115 ; port AMC_P2P.Tx12_P
Tx13_N: J3.120 ; port AMC_P2P.Tx13_N
Tx13_P: J3.121 ; port AMC_P2P.Tx13_P
Tx14_N: J3.126 ; port AMC_P2P.Tx14_N
Tx14_P: J3.127 ; port AMC_P2P.Tx14_P
Tx15_N: J3.132 ; port AMC_P2P.Tx15_N
Tx15_P: J3.133 ; port AMC_P2P.Tx15_P
Tx17_N: J3.144 ; port MLVDS.Tx17_N  [project net MLVDS_A.Tx17_N]
Tx17_P: J3.145 ; port MLVDS.Tx17_P  [project net MLVDS_A.Tx17_P]
Tx18_N: J3.150 ; port MLVDS.Tx18_N  [project net MLVDS_A.Tx18_N]
Tx18_P: J3.151 ; port MLVDS.Tx18_P  [project net MLVDS_A.Tx18_P]
Tx19_N: J3.156 ; port MLVDS.Tx19_N  [project net MLVDS_A.Tx19_N]
Tx19_P: J3.157 ; port MLVDS.Tx19_P  [project net MLVDS_A.Tx19_P]
Tx20_N: J3.162 ; port MLVDS.Tx20_N  [project net MLVDS_A.Tx20_N]
Tx20_P: J3.163 ; port MLVDS.Tx20_P  [project net MLVDS_A.Tx20_P]

Not connected (* = marked no-connect by the designer): J3 6* 8* 171* 172* 173* 174* 175* 176* 177* 178* 179* 180* 181* 182* 183* 184* 185* 186* 187* 188* 189* 190* 191* 192* 193* 194* 195* 196* 197* 198* 199* 200* 201* 202* 203* 204* 205* 206* 207* 208* 209* 210* 211* 212* 213* 214* 215* 216* 217* 218* 219* 220* 221* 222* 223* 224* 225* 226* 227* 228* 229* 230* 231* 232* 233* 234* 235* 236* 237* 238* 239* 240* 241* 242* 243* 244* 245* 246* 247* 248* 249* 250* 251* 252* 253* 254* 255* 256* 257* 258* 259* 260* 261* 262* 263* 264* 265* 266* 267* 268* 269* 270* 271* 272* 273* 274*

### Layout directives
differential pair: MGT.FCLK_GTP216_CLK0_N, MGT.FCLK_GTP216_CLK0_P, MLVDS_A.Rx17_N, MLVDS_A.Rx17_P, MLVDS_A.Rx18_N, MLVDS_A.Rx18_P, MLVDS_A.Rx19_N, MLVDS_A.Rx19_P, MLVDS_A.Rx20_N, MLVDS_A.Rx20_P, MLVDS_A.Tx17_N, MLVDS_A.Tx17_P, MLVDS_A.Tx18_N, MLVDS_A.Tx18_P, MLVDS_A.Tx19_N, MLVDS_A.Tx19_P, MLVDS_A.Tx20_N, MLVDS_A.Tx20_P, PIPE1.Rx4_N, PIPE1.Rx4_P, PIPE1.Rx5_N, PIPE1.Rx5_P, PIPE1.Rx6_N, PIPE1.Rx6_P, PIPE1.Rx7_N, PIPE1.Rx7_P, PIPE1.Tx4_N, PIPE1.Tx4_P, PIPE1.Tx5_N, PIPE1.Tx5_P, PIPE1.Tx6_N, PIPE1.Tx6_P, PIPE1.Tx7_N, PIPE1.Tx7_P, PIPE2.Rx8_N, PIPE2.Rx8_P, PIPE2.Rx9_N, PIPE2.Rx9_P, PIPE2.Rx10_N, PIPE2.Rx10_P, PIPE2.Rx11_N, PIPE2.Rx11_P, PIPE2.Tx8_N, PIPE2.Tx8_P, PIPE2.Tx9_N, PIPE2.Tx9_P, PIPE2.Tx10_N, PIPE2.Tx10_P, PIPE2.Tx11_N, PIPE2.Tx11_P, PORT0.Rx0_N, PORT0.Rx0_P, PORT0.Tx0_N, PORT0.Tx0_P, PORT1.Rx1_N, PORT1.Rx1_P, PORT1.Tx1_N, PORT1.Tx1_P, PORT2.Rx2_N, PORT2.Rx2_P, PORT2.Tx2_N, PORT2.Tx2_P, PORT3.Rx3_N, PORT3.Rx3_P, PORT3.Tx3_N, PORT3.Tx3_P, Rx12_N, Rx12_P, Rx13_N, Rx13_P, Rx14_N, Rx14_P, Rx15_N, Rx15_P, TCLKA_N, TCLKA_P, TCLKB_N, TCLKB_P, TCLKC_N, TCLKC_P, TCLKD_N, TCLKD_P, Tx12_N, Tx12_P, Tx13_N, Tx13_P, Tx14_N, Tx14_P, Tx15_N, Tx15_P

### Notes on the sheet
- RSRVD6
- RSRVD8
- NC
- P2P Signals - NOT USED
- - Dimensions are in MM, nominal values used
  - Component height rule derived from AMC Base Specification.PDF, Page 62
  - The two corners of outline near the edge-connector are approximated, see AMC Base Specification.PDF, Page 59
  - Stackup is not specified in AMC Base Specification.PDF or implemented in this template.
- Project/Equipment
- Document
- Designer
- Drawn by
- Check.by
- Copyright CNPEM 2013, WUT ISE 2020
  This documentation describes Open Hardware and is licensed under CERN OHL v.1.1. You may redistribute and modify this documentaction under the terms of the CERN OHL v1.1.
  (http://ohwr.org/CERNOHL). This documentation is dristributed WITHOUT ANY EXPRESS OR IMPLIED WARRANTY, INCLUDING OF MERCHANTABLITY, SATISFACTORY QUALITY AND FITNESS FOR A PARTICULAR PURPOSE. Please see the CERN OHL v.1.1 for applicable conditions
- File
- Last Mod.
- Print Date
- Sheet
- Size
- A3
- of
- Rev
- Contact:
- (in symbol R1206_100K_1%_0.25W_100PPM) 1%

### Library data of the parts
D2 = SS16: Schottky Diode; Part Description: Surface Mount Schottky Barrier Rectifier; Manufacturer: VISHAY GENERAL SEMICONDUCTOR; Voltage: 60V; Power: 1A; Table: Diodes; Part Number: SS16; Component Kind: Standard; Component Type: Standard; Device: SS16; PackageDescription: DO-214-AC Molded Diode, Body 5.1x2.7mm, IPC Medium Density; Manufacturer Part Number: SS16; Pin Count: 2; Case: DO-214AC; Mounted: Yes; Socket: No; SMD: Yes; ComponentHeight: 2.29mm; HelpURL: \\cern.ch\dfs\Applications\Altium\Datasheets\SS16.pdf; Author: CERN DEM JLC; CreateDate: 2008-07-15; LatestRevisionDate: 2010-08-23
J3 = CMP-0001-00058-2: Golden finger, AMC, Dual, Opposite, Pitch 0.75mm, 170-Position; Package Version: rev2.0, Nov-2006; Mating Connector: Molex-0758000001; Datasheet Version: rev2.0, Nov-2006; ClassName: Edge Connector; Package Reference: AMC-GF-2D-750-O274; Publisher: Altium
R320 R321 = R1206_100K_1%_0.25W_100PPM: Resistor - 1%; Part Description: General Purpose Thick Film Chip Resistor; Manufacturer: GENERIC; Manufacturer1 Part Number: NRC12F1003TRF; Power: 0.25W; TC: ±100ppm/°C; Table: Resistors SMD; Part Number: R1206_100K_1%_0.25W_100PPM; Component Kind: Standard; Component Type: Standard; Pin Count: 2; Value: 100k; Status: Preferred; Tolerance: ±1%; Manufacturer Part Number: R1206_100K_1%_0.25W_100PPM; Case: 1206; Mounted: Yes; Socket: No; SMD: Yes; Manufacturer1 Example: NIC COMPONENT; Manufacturer1 ComponentHeight: 0.65mm; HelpURL: \\cern.ch\dfs\Applications\Altium\Datasheets\R1206_NIC_NRC.pdf; Author: CERN DEM JLC; CreateDate: 2007-12-03; LatestRevisionDate: 2008-03-13

## Sheet FMC_connector.SchDoc: AMC FMC Carrier v4
size A2; CompanyName: WUT; Organization: WUT ISE; Address1: Warsaw University of Technology; Address2: Nowowiejska 15/19 00-665 Warsaw; Address3: t.przywozki@gmail.com; Revision: 1; SheetNumber: 27; SheetTotal: 29; Project: AMC FMC Carrier v4.0.2; ModifiedBy: F. Świtakowski; CheckedDate: -; Title2: FMC connector; DivGrp: ISE; Designer: T. Przywozki; ModifiedDate: -; ProjectName: ADC/DAC MEZZANINE
Used 2 times, as channels HPC1, HPC2. Parts and nets are listed once, with the designators drawn on the sheet.
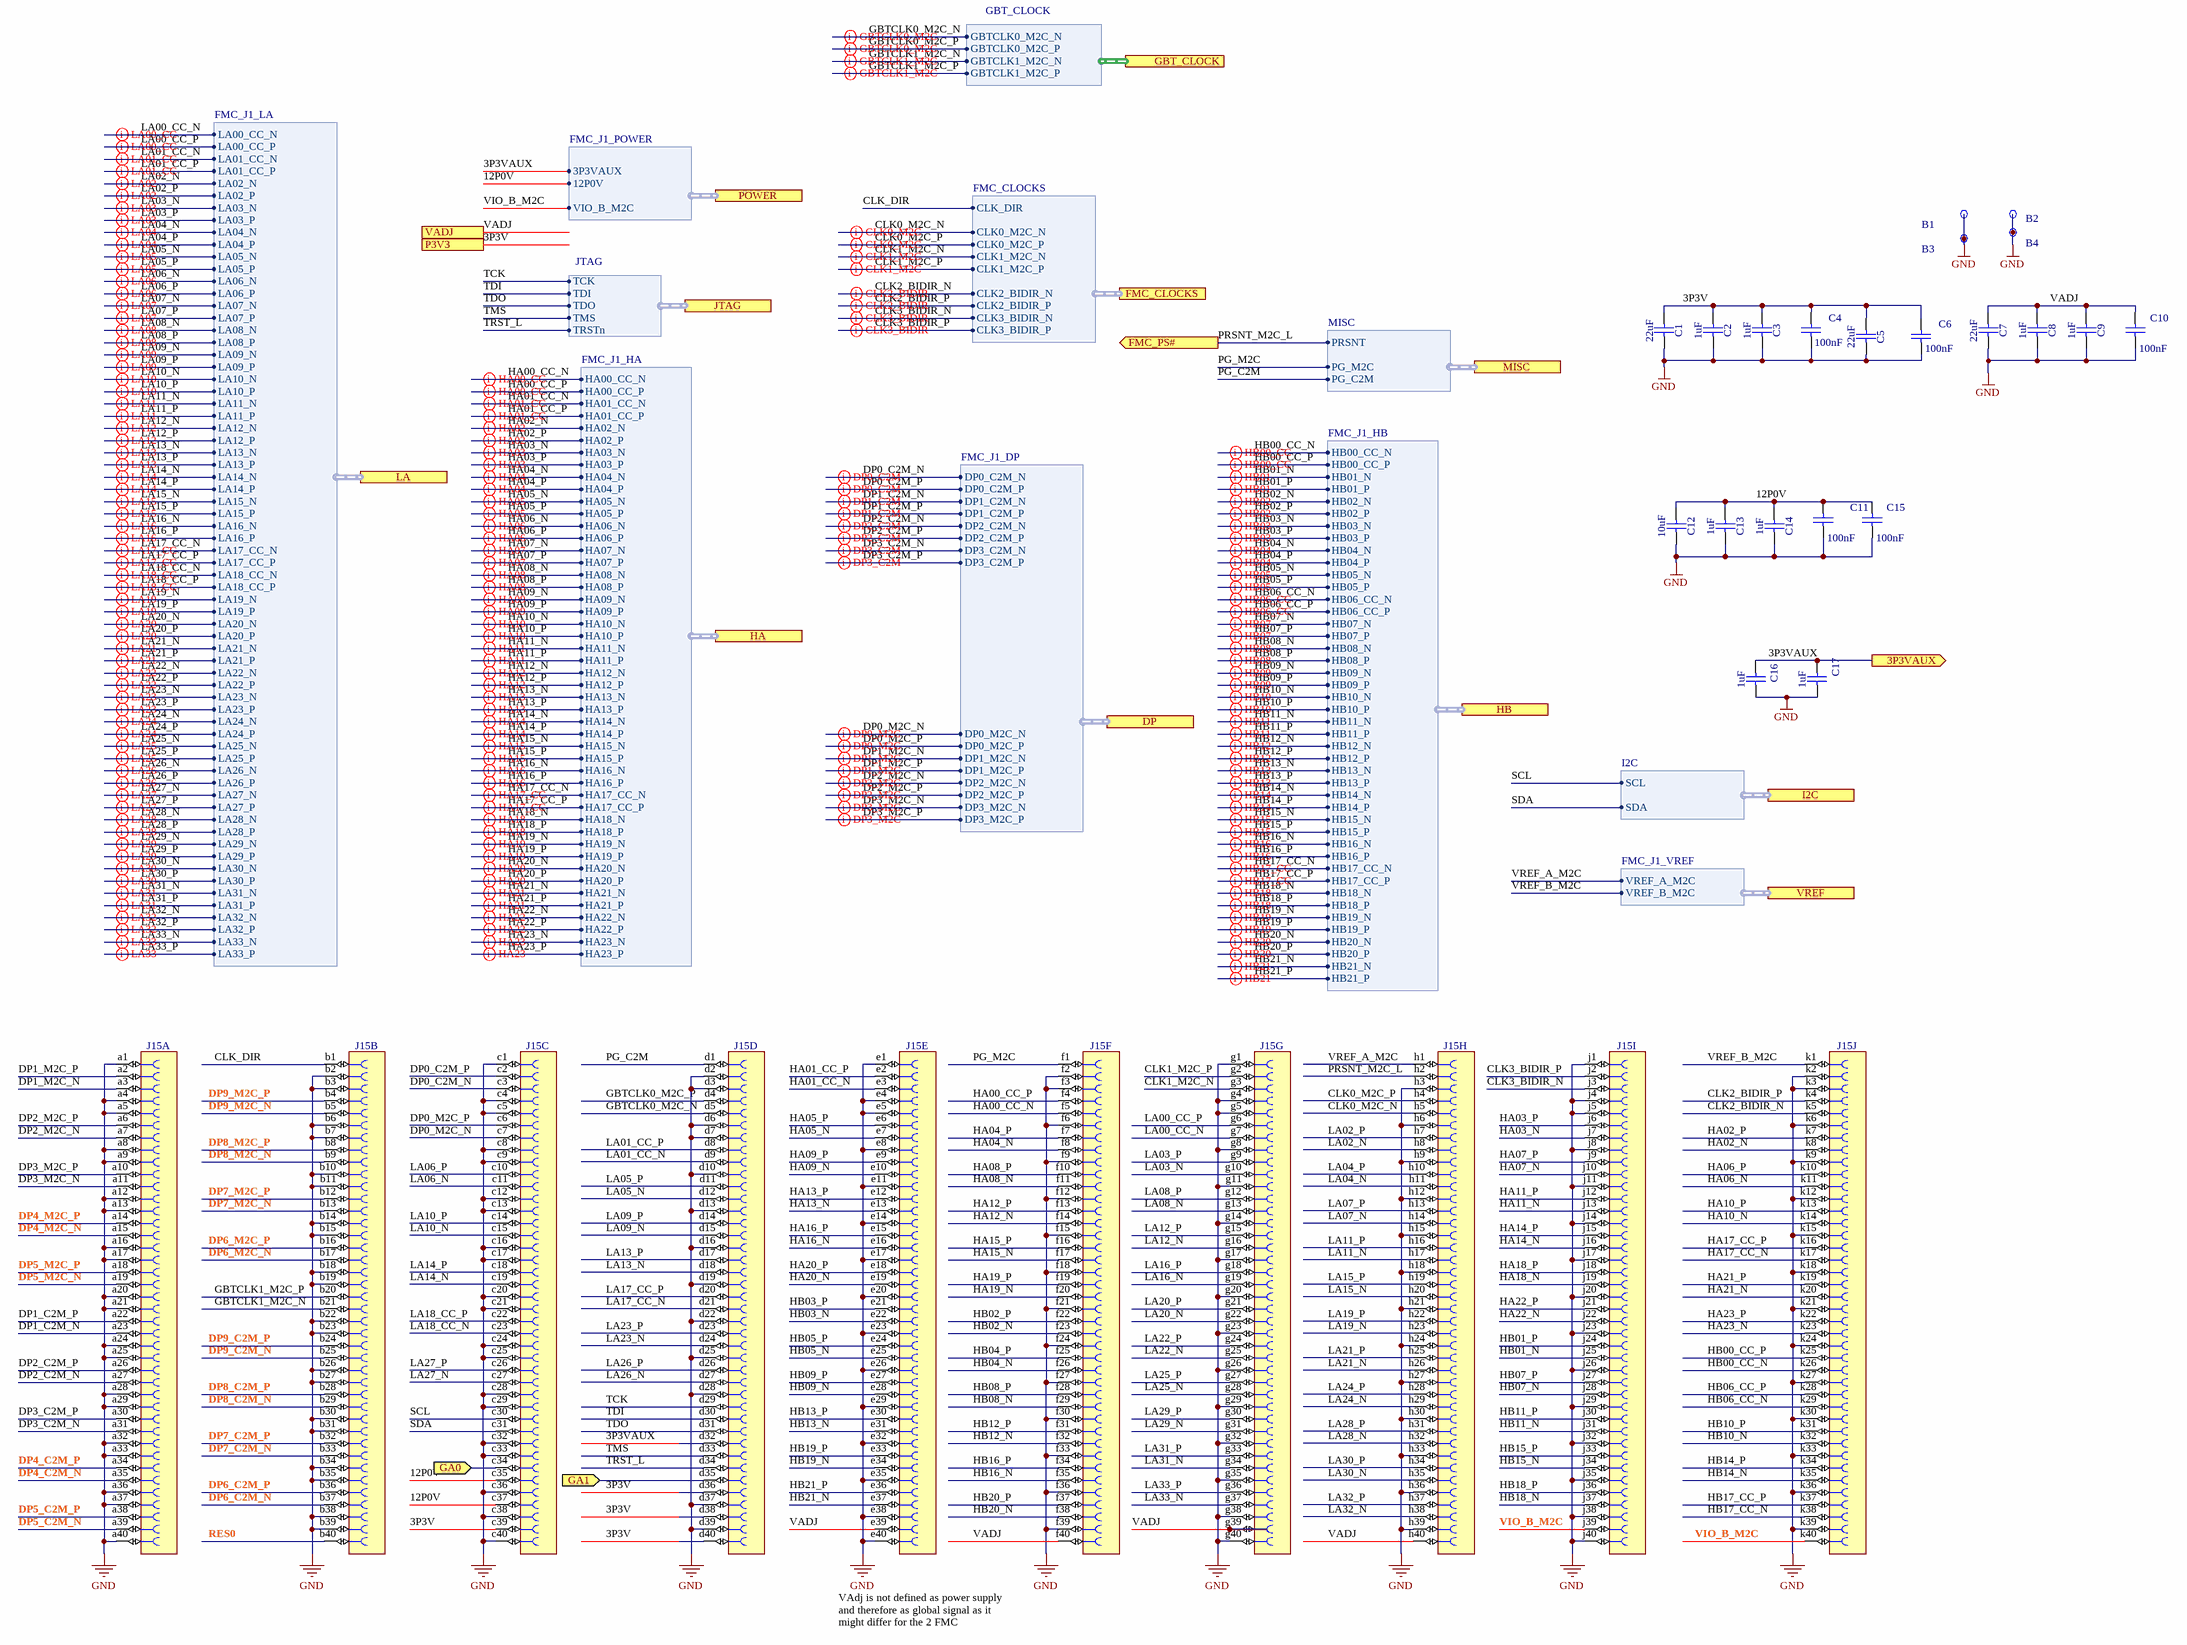
[diagram p2: FMC_connector.SchDoc]

### Parts
B1  Plated Hole  [MTG270_500]  (value not drawn)  (no BOM)
B2  Plated Hole  [MTG270_500]  (value not drawn)  (no BOM)
B3  Plated Hole  [MTG270_500]  (value not drawn)  (no BOM)
B4  Plated Hole  [MTG270_500]  (value not drawn)  (no BOM)
C1  22uF  [CAPC3216X180N]
C2  1uF  [CAPC1608X87N]
C3  1uF  [CAPC1608X87N]
C4  100nF  [CAPC0603X33N]
C5  22uF  [CAPC3216X180N]
C6  100nF  [CAPC0603X33N]
C7  22uF  [CAPC3216X180N]
C8  1uF  [CAPC1608X87N]
C9  1uF  [CAPC1608X87N]
C10  100nF  [CAPC0603X33N]
C11  100nF  [CAPC0603X33N]
C12  10uF  [CAPC2012X135N]
C13  1uF  [CAPC1608X87N]
C14  1uF  [CAPC1608X87N]
C15  100nF  [CAPC0603X33N]
C16  1uF  [CAPC1608X87N]
C17  1uF  [CAPC1608X87N]
J15  VITA 57  [SAMTEC_ASP-134486-01]  (value not drawn)  (parts A,B,C,D,E,F,G,H,I,J of 10)

### Ports
3P3VAUX (out), DP (harness FMC_J1_DP), FMC_CLOCKS (harness FMC_CLOCKS), FMC_PS# (out), GA0 (in), GA1 (in), GBT_CLOCK (harness GBT_CLOCK), HA (harness FMC_J1_HA), HB (harness FMC_J1_HB), I2C (harness I2C), JTAG (harness JTAG), LA (harness FMC_J1_LA), MISC (harness MISC), P3V3, POWER (harness FMC_J1_POWER), VADJ, VREF (harness FMC_J1_VREF)

### Harnesses
FMC_J1_DP: DP1_C2M_N, DP1_C2M_P, DP1_M2C_N, DP1_M2C_P, DP2_C2M_N, DP2_C2M_P, DP2_M2C_N, DP2_M2C_P, DP3_C2M_N, DP3_C2M_P, DP3_M2C_N, DP3_M2C_P, DP0_C2M_N, DP0_C2M_P, DP0_M2C_N, DP0_M2C_P
FMC_J1_LA: LA05_N, LA05_P, LA06_N, LA06_P, LA09_N, LA09_P, LA10_N, LA10_P, LA13_N, LA13_P, LA14_N, LA14_P, LA23_N, LA23_P, LA26_N, LA26_P, LA27_N, LA27_P, LA02_N, LA02_P, LA03_N, LA03_P, LA04_N, LA04_P, LA07_N, LA07_P, LA08_N, LA08_P, LA11_N, LA11_P, LA12_N, LA12_P, LA15_N, LA15_P, LA16_N, LA16_P, LA19_N, LA19_P, LA20_N, LA20_P, LA21_N, LA21_P, LA22_N, LA22_P, LA24_N, LA24_P, LA25_N, LA25_P, LA28_N, LA28_P, LA29_N, LA29_P, LA30_N, LA30_P, LA31_N, LA31_P, LA32_N, LA32_P, LA33_N, LA33_P, LA00_CC_N, LA00_CC_P, LA01_CC_N, LA01_CC_P, LA17_CC_N, LA17_CC_P, LA18_CC_N, LA18_CC_P
FMC_J1_HA: HA04_N, HA04_P, HA05_N, HA05_P, HA08_N, HA08_P, HA09_N, HA09_P, HA12_N, HA12_P, HA13_N, HA13_P, HA15_N, HA15_P, HA16_N, HA16_P, HA19_N, HA19_P, HA20_N, HA20_P, HA02_N, HA02_P, HA03_N, HA03_P, HA06_N, HA06_P, HA07_N, HA07_P, HA10_N, HA10_P, HA11_N, HA11_P, HA14_N, HA14_P, HA18_N, HA18_P, HA21_N, HA21_P, HA22_N, HA22_P, HA23_N, HA23_P, HA17_CC_N, HA17_CC_P, HA00_CC_N, HA00_CC_P, HA01_CC_N, HA01_CC_P
FMC_J1_HB: HB02_N, HB02_P, HB03_N, HB03_P, HB04_N, HB04_P, HB05_N, HB05_P, HB08_N, HB08_P, HB09_N, HB09_P, HB12_N, HB12_P, HB13_N, HB13_P, HB16_N, HB16_P, HB19_N, HB19_P, HB20_N, HB20_P, HB21_N, HB21_P, HB01_N, HB01_P, HB07_N, HB07_P, HB10_N, HB10_P, HB11_N, HB11_P, HB14_N, HB14_P, HB15_N, HB15_P, HB18_N, HB18_P, HB17_CC_N, HB17_CC_P, HB06_CC_N, HB06_CC_P, HB00_CC_N, HB00_CC_P
FMC_J1_POWER: 3P3VAUX, 12P0V, VIO_B_M2C
I2C: SCL, SDA
FMC_CLOCKS: CLK2_BIDIR_N, CLK2_BIDIR_P, CLK3_BIDIR_N, CLK3_BIDIR_P, CLK0_M2C_N, CLK0_M2C_P, CLK1_M2C_N, CLK1_M2C_P, CLK_DIR
FMC_J1_VREF: VREF_A_M2C, VREF_B_M2C
GBT_CLOCK: GBTCLK0_M2C_N, GBTCLK0_M2C_P, GBTCLK1_M2C_N, GBTCLK1_M2C_P
MISC: PRSNT, PG_M2C, PG_C2M
JTAG: TCK, TDI, TDO, TMS, TRSTn

### Nets
GND: B1.1 B2.1 B3.1 B4.1 C1.2 C2.2 C3.2 C4.1 C5.2 C6.1 C7.2 C8.2 C9.2 C10.1 C11.1 C12.2 C13.2 C14.2 C15.1 C16.2 C17.2 J15.a1 J15.a4 J15.a5 J15.a8 J15.a9 J15.a12 J15.a13 J15.a16 J15.a17 J15.a20 J15.a21 J15.a24 J15.a25 J15.a28 J15.a29 J15.a32 J15.a33 J15.a36 J15.a37 J15.a40 J15.b2 J15.b3 J15.b6 J15.b7 J15.b10 J15.b11 J15.b14 J15.b15 J15.b18 J15.b19 J15.b22 J15.b23 J15.b26 J15.b27 J15.b30 J15.b31 J15.b34 J15.b35 J15.b38 J15.b39 J15.c1 J15.c4 J15.c5 J15.c8 J15.c9 J15.c12 J15.c13 J15.c16 J15.c17 J15.c20 J15.c21 J15.c24 J15.c25 J15.c28 J15.c29 J15.c32 J15.c33 J15.c36 J15.c38 J15.c40 J15.d2 J15.d3 J15.d6 J15.d7 J15.d10 J15.d13 J15.d16 J15.d19 J15.d22 J15.d25 J15.d28 J15.d37 J15.d39 J15.e1 J15.e4 J15.e5 J15.e8 J15.e11 J15.e14 J15.e17 J15.e20 J15.e23 J15.e26 J15.e29 J15.e32 J15.e35 J15.e38 J15.e40 J15.f2 J15.f3 J15.f6 J15.f9 J15.f12 J15.f15 J15.f18 J15.f21 J15.f24 J15.f27 J15.f30 J15.f33 J15.f36 J15.f39 J15.g1 J15.g4 J15.g5 J15.g8 J15.g11 J15.g14 J15.g17 J15.g20 J15.g23 J15.g26 J15.g29 J15.g32 J15.g35 J15.g38 J15.g40 J15.h3 J15.h6 J15.h9 J15.h12 J15.h15 J15.h18 J15.h21 J15.h24 J15.h27 J15.h30 J15.h33 J15.h36 J15.h39 J15.j1 J15.j4 J15.j5 J15.j8 J15.j11 J15.j14 J15.j17 J15.j20 J15.j23 J15.j26 J15.j29 J15.j32 J15.j35 J15.j38 J15.j40 J15.k2 J15.k3 J15.k6 J15.k9 J15.k12 J15.k15 J15.k18 J15.k21 J15.k24 J15.k27 J15.k30 J15.k33 J15.k36 J15.k39
3P3V: C1.1 C2.1 C3.1 C4.2 C5.1 C6.2 J15.c39 J15.d36 J15.d38 J15.d40 ; port P3V3
3P3VAUX: C16.1 C17.1 J15.d32 ; port 3P3VAUX, port POWER.3P3VAUX
12P0V: C11.2 C12.1 C13.1 C14.1 C15.2 J15.c35 J15.c37 ; port POWER.12P0V
CLK0_M2C_N: J15.h5 ; port FMC_CLOCKS.CLK0_M2C_N
CLK0_M2C_P: J15.h4 ; port FMC_CLOCKS.CLK0_M2C_P
CLK1_M2C_N: J15.g3 ; port FMC_CLOCKS.CLK1_M2C_N
CLK1_M2C_P: J15.g2 ; port FMC_CLOCKS.CLK1_M2C_P
CLK2_BIDIR_N: J15.k5 ; port FMC_CLOCKS.CLK2_BIDIR_N
CLK2_BIDIR_P: J15.k4 ; port FMC_CLOCKS.CLK2_BIDIR_P
CLK3_BIDIR_N: J15.j3 ; port FMC_CLOCKS.CLK3_BIDIR_N
CLK3_BIDIR_P: J15.j2 ; port FMC_CLOCKS.CLK3_BIDIR_P
CLK_DIR: J15.b1 ; port FMC_CLOCKS.CLK_DIR
DP0_C2M_N: J15.c3 ; port DP.DP0_C2M_N
DP0_C2M_P: J15.c2 ; port DP.DP0_C2M_P
DP0_M2C_N: J15.c7 ; port DP.DP0_M2C_N
DP0_M2C_P: J15.c6 ; port DP.DP0_M2C_P
DP1_C2M_N: J15.a23 ; port DP.DP1_C2M_N
DP1_C2M_P: J15.a22 ; port DP.DP1_C2M_P
DP1_M2C_N: J15.a3 ; port DP.DP1_M2C_N
DP1_M2C_P: J15.a2 ; port DP.DP1_M2C_P
DP2_C2M_N: J15.a27 ; port DP.DP2_C2M_N
DP2_C2M_P: J15.a26 ; port DP.DP2_C2M_P
DP2_M2C_N: J15.a7 ; port DP.DP2_M2C_N
DP2_M2C_P: J15.a6 ; port DP.DP2_M2C_P
DP3_C2M_N: J15.a31 ; port DP.DP3_C2M_N
DP3_C2M_P: J15.a30 ; port DP.DP3_C2M_P
DP3_M2C_N: J15.a11 ; port DP.DP3_M2C_N
DP3_M2C_P: J15.a10 ; port DP.DP3_M2C_P
GA0: J15.c34 ; port GA0
GA1: J15.d35 ; port GA1
GBTCLK0_M2C_N: J15.d5 ; port GBT_CLOCK.GBTCLK0_M2C_N
GBTCLK0_M2C_P: J15.d4 ; port GBT_CLOCK.GBTCLK0_M2C_P
GBTCLK1_M2C_N: J15.b21 ; port GBT_CLOCK.GBTCLK1_M2C_N
GBTCLK1_M2C_P: J15.b20 ; port GBT_CLOCK.GBTCLK1_M2C_P
HA00_CC_N: J15.f5 ; port HA.HA00_CC_N
HA00_CC_P: J15.f4 ; port HA.HA00_CC_P
HA01_CC_N: J15.e3 ; port HA.HA01_CC_N
HA01_CC_P: J15.e2 ; port HA.HA01_CC_P
HA02_N: J15.k8 ; port HA.HA02_N
HA02_P: J15.k7 ; port HA.HA02_P
HA03_N: J15.j7 ; port HA.HA03_N
HA03_P: J15.j6 ; port HA.HA03_P
HA04_N: J15.f8 ; port HA.HA04_N
HA04_P: J15.f7 ; port HA.HA04_P
HA05_N: J15.e7 ; port HA.HA05_N
HA05_P: J15.e6 ; port HA.HA05_P
HA06_N: J15.k11 ; port HA.HA06_N
HA06_P: J15.k10 ; port HA.HA06_P
HA07_N: J15.j10 ; port HA.HA07_N
HA07_P: J15.j9 ; port HA.HA07_P
HA08_N: J15.f11 ; port HA.HA08_N
HA08_P: J15.f10 ; port HA.HA08_P
HA09_N: J15.e10 ; port HA.HA09_N
HA09_P: J15.e9 ; port HA.HA09_P
HA10_N: J15.k14 ; port HA.HA10_N
HA10_P: J15.k13 ; port HA.HA10_P
HA11_N: J15.j13 ; port HA.HA11_N
HA11_P: J15.j12 ; port HA.HA11_P
HA12_N: J15.f14 ; port HA.HA12_N
HA12_P: J15.f13 ; port HA.HA12_P
HA13_N: J15.e13 ; port HA.HA13_N
HA13_P: J15.e12 ; port HA.HA13_P
HA14_N: J15.j16 ; port HA.HA14_N
HA14_P: J15.j15 ; port HA.HA14_P
HA15_N: J15.f17 ; port HA.HA15_N
HA15_P: J15.f16 ; port HA.HA15_P
HA16_N: J15.e16 ; port HA.HA16_N
HA16_P: J15.e15 ; port HA.HA16_P
HA17_CC_N: J15.k17 ; port HA.HA17_CC_N
HA17_CC_P: J15.k16 ; port HA.HA17_CC_P
HA18_N: J15.j19 ; port HA.HA18_N
HA18_P: J15.j18 ; port HA.HA18_P
HA19_N: J15.f20 ; port HA.HA19_N
HA19_P: J15.f19 ; port HA.HA19_P
HA20_N: J15.e19 ; port HA.HA20_N
HA20_P: J15.e18 ; port HA.HA20_P
HA21_N: J15.k20 ; port HA.HA21_N
HA21_P: J15.k19 ; port HA.HA21_P
HA22_N: J15.j22 ; port HA.HA22_N
HA22_P: J15.j21 ; port HA.HA22_P
HA23_N: J15.k23 ; port HA.HA23_N
HA23_P: J15.k22 ; port HA.HA23_P
HB00_CC_N: J15.k26 ; port HB.HB00_CC_N
HB00_CC_P: J15.k25 ; port HB.HB00_CC_P
HB01_N: J15.j25 ; port HB.HB01_N
HB01_P: J15.j24 ; port HB.HB01_P
HB02_N: J15.f23 ; port HB.HB02_N
HB02_P: J15.f22 ; port HB.HB02_P
HB03_N: J15.e22 ; port HB.HB03_N
HB03_P: J15.e21 ; port HB.HB03_P
HB04_N: J15.f26 ; port HB.HB04_N
HB04_P: J15.f25 ; port HB.HB04_P
HB05_N: J15.e25 ; port HB.HB05_N
HB05_P: J15.e24 ; port HB.HB05_P
HB06_CC_N: J15.k29 ; port HB.HB06_CC_N
HB06_CC_P: J15.k28 ; port HB.HB06_CC_P
HB07_N: J15.j28 ; port HB.HB07_N
HB07_P: J15.j27 ; port HB.HB07_P
HB08_N: J15.f29 ; port HB.HB08_N
HB08_P: J15.f28 ; port HB.HB08_P
HB09_N: J15.e28 ; port HB.HB09_N
HB09_P: J15.e27 ; port HB.HB09_P
HB10_N: J15.k32 ; port HB.HB10_N
HB10_P: J15.k31 ; port HB.HB10_P
HB11_N: J15.j31 ; port HB.HB11_N
HB11_P: J15.j30 ; port HB.HB11_P
HB12_N: J15.f32 ; port HB.HB12_N
HB12_P: J15.f31 ; port HB.HB12_P
HB13_N: J15.e31 ; port HB.HB13_N
HB13_P: J15.e30 ; port HB.HB13_P
HB14_N: J15.k35 ; port HB.HB14_N
HB14_P: J15.k34 ; port HB.HB14_P
HB15_N: J15.j34 ; port HB.HB15_N
HB15_P: J15.j33 ; port HB.HB15_P
HB16_N: J15.f35 ; port HB.HB16_N
HB16_P: J15.f34 ; port HB.HB16_P
HB17_CC_N: J15.k38 ; port HB.HB17_CC_N
HB17_CC_P: J15.k37 ; port HB.HB17_CC_P
HB18_N: J15.j37 ; port HB.HB18_N
HB18_P: J15.j36 ; port HB.HB18_P
HB19_N: J15.e34 ; port HB.HB19_N
HB19_P: J15.e33 ; port HB.HB19_P
HB20_N: J15.f38 ; port HB.HB20_N
HB20_P: J15.f37 ; port HB.HB20_P
HB21_N: J15.e37 ; port HB.HB21_N
HB21_P: J15.e36 ; port HB.HB21_P
LA00_CC_N: J15.g7 ; port LA.LA00_CC_N
LA00_CC_P: J15.g6 ; port LA.LA00_CC_P
LA01_CC_N: J15.d9 ; port LA.LA01_CC_N
LA01_CC_P: J15.d8 ; port LA.LA01_CC_P
LA02_N: J15.h8 ; port LA.LA02_N
LA02_P: J15.h7 ; port LA.LA02_P
LA03_N: J15.g10 ; port LA.LA03_N
LA03_P: J15.g9 ; port LA.LA03_P
LA04_N: J15.h11 ; port LA.LA04_N
LA04_P: J15.h10 ; port LA.LA04_P
LA05_N: J15.d12 ; port LA.LA05_N
LA05_P: J15.d11 ; port LA.LA05_P
LA06_N: J15.c11 ; port LA.LA06_N
LA06_P: J15.c10 ; port LA.LA06_P
LA07_N: J15.h14 ; port LA.LA07_N
LA07_P: J15.h13 ; port LA.LA07_P
LA08_N: J15.g13 ; port LA.LA08_N
LA08_P: J15.g12 ; port LA.LA08_P
LA09_N: J15.d15 ; port LA.LA09_N
LA09_P: J15.d14 ; port LA.LA09_P
LA10_N: J15.c15 ; port LA.LA10_N
LA10_P: J15.c14 ; port LA.LA10_P
LA11_N: J15.h17 ; port LA.LA11_N
LA11_P: J15.h16 ; port LA.LA11_P
LA12_N: J15.g16 ; port LA.LA12_N
LA12_P: J15.g15 ; port LA.LA12_P
LA13_N: J15.d18 ; port LA.LA13_N
LA13_P: J15.d17 ; port LA.LA13_P
LA14_N: J15.c19 ; port LA.LA14_N
LA14_P: J15.c18 ; port LA.LA14_P
LA15_N: J15.h20 ; port LA.LA15_N
LA15_P: J15.h19 ; port LA.LA15_P
LA16_N: J15.g19 ; port LA.LA16_N
LA16_P: J15.g18 ; port LA.LA16_P
LA17_CC_N: J15.d21 ; port LA.LA17_CC_N
LA17_CC_P: J15.d20 ; port LA.LA17_CC_P
LA18_CC_N: J15.c23 ; port LA.LA18_CC_N
LA18_CC_P: J15.c22 ; port LA.LA18_CC_P
LA19_N: J15.h23 ; port LA.LA19_N
LA19_P: J15.h22 ; port LA.LA19_P
LA20_N: J15.g22 ; port LA.LA20_N
LA20_P: J15.g21 ; port LA.LA20_P
LA21_N: J15.h26 ; port LA.LA21_N
LA21_P: J15.h25 ; port LA.LA21_P
LA22_N: J15.g25 ; port LA.LA22_N
LA22_P: J15.g24 ; port LA.LA22_P
LA23_N: J15.d24 ; port LA.LA23_N
LA23_P: J15.d23 ; port LA.LA23_P
LA24_N: J15.h29 ; port LA.LA24_N
LA24_P: J15.h28 ; port LA.LA24_P
LA25_N: J15.g28 ; port LA.LA25_N
LA25_P: J15.g27 ; port LA.LA25_P
LA26_N: J15.d27 ; port LA.LA26_N
LA26_P: J15.d26 ; port LA.LA26_P
LA27_N: J15.c27 ; port LA.LA27_N
LA27_P: J15.c26 ; port LA.LA27_P
LA28_N: J15.h32 ; port LA.LA28_N
LA28_P: J15.h31 ; port LA.LA28_P
LA29_N: J15.g31 ; port LA.LA29_N
LA29_P: J15.g30 ; port LA.LA29_P
LA30_N: J15.h35 ; port LA.LA30_N
LA30_P: J15.h34 ; port LA.LA30_P
LA31_N: J15.g34 ; port LA.LA31_N
LA31_P: J15.g33 ; port LA.LA31_P
LA32_N: J15.h38 ; port LA.LA32_N
LA32_P: J15.h37 ; port LA.LA32_P
LA33_N: J15.g37 ; port LA.LA33_N
LA33_P: J15.g36 ; port LA.LA33_P
PG_C2M: J15.d1 ; port MISC.PG_C2M
PG_M2C: J15.f1 ; port MISC.PG_M2C
PRSNT_M2C_L: J15.h2 ; port FMC_PS#, port MISC.PRSNT
SCL: J15.c30 ; port I2C.SCL
SDA: J15.c31 ; port I2C.SDA
TCK: J15.d29 ; port JTAG.TCK
TDI: J15.d30 ; port JTAG.TDI
TDO: J15.d31 ; port JTAG.TDO
TMS: J15.d33 ; port JTAG.TMS
TRST_L: J15.d34 ; port JTAG.TRSTn
VADJ: C7.1 C8.1 C9.1 C10.2 J15.e39 J15.f40 J15.g39 J15.h40 ; port VADJ
VIO_B_M2C: port POWER.VIO_B_M2C
VREF_A_M2C: J15.h1 ; port VREF.VREF_A_M2C
VREF_B_M2C: J15.k1 ; port VREF.VREF_B_M2C

Not connected (* = marked no-connect by the designer): J15 a14 a15 a18 a19 a34 a35 a38 a39 b4 b5 b8 b9 b12 b13 b16 b17 b24 b25 b28 b29 b32 b33 b36 b37 b40 j39 k40

### Channels
HPC1: designators end in A; ports 3P3VAUX=FMC1_3P3VAUX FMC_PS#=FMC_PRSNT.FMC1_PRSNT_M2C_L GA0=GND GA1=GND P3V3=FMC1_P3V3 VADJ=PVADJ1
HPC2: designators end in B; ports 3P3VAUX=FMC2_3P3VAUX FMC_PS#=FMC_PRSNT.FMC2_PRSNT_M2C_L GA0=3P3VAUX_R GA1=GND P3V3=FMC2_P3V3 VADJ=PVADJ2

### Layout directives
differential pair: CLKS1.CLK0_M2C_N, CLKS1.CLK0_M2C_P, CLKS1.CLK1_M2C_N, CLKS1.CLK1_M2C_P, CLKS1.CLK2_BIDIR_N, CLKS1.CLK2_BIDIR_P, CLKS1.CLK3_BIDIR_N, CLKS1.CLK3_BIDIR_P, DP1.DP0_C2M_N, DP1.DP0_C2M_P, DP1.DP0_M2C_N, DP1.DP0_M2C_P, DP1.DP1_C2M_N, DP1.DP1_C2M_P, DP1.DP1_M2C_N, DP1.DP1_M2C_P, DP1.DP2_C2M_N, DP1.DP2_C2M_P, DP1.DP2_M2C_N, DP1.DP2_M2C_P, DP1.DP3_C2M_N, DP1.DP3_C2M_P, DP1.DP3_M2C_N, DP1.DP3_M2C_P, GBT1.GBTCLK0_M2C_N, GBT1.GBTCLK0_M2C_P, GBT1.GBTCLK1_M2C_N, GBT1.GBTCLK1_M2C_P, HA1.HA00_CC_N, HA1.HA00_CC_P, HA1.HA01_CC_N, HA1.HA01_CC_P, HA1.HA02_N, HA1.HA02_P, HA1.HA03_N, HA1.HA03_P, HA1.HA04_N, HA1.HA04_P, HA1.HA05_N, HA1.HA05_P, HA1.HA06_N, HA1.HA06_P, HA1.HA07_N, HA1.HA07_P, HA1.HA08_N, HA1.HA08_P, HA1.HA09_N, HA1.HA09_P, HA1.HA10_N, HA1.HA10_P, HA1.HA11_N, HA1.HA11_P, HA1.HA12_N, HA1.HA12_P, HA1.HA13_N, HA1.HA13_P, HA1.HA14_N, HA1.HA14_P, HA1.HA15_N, HA1.HA15_P, HA1.HA16_N, HA1.HA16_P, HA1.HA17_CC_N, HA1.HA17_CC_P, HA1.HA18_N, HA1.HA18_P, HA1.HA19_N, HA1.HA19_P, HA1.HA20_N, HA1.HA20_P, HA1.HA21_N, HA1.HA21_P, HA1.HA22_N, HA1.HA22_P, HA1.HA23_N, HA1.HA23_P, HB1.HB00_CC_N, HB1.HB00_CC_P, HB1.HB01_N, HB1.HB01_P, HB1.HB02_N, HB1.HB02_P, HB1.HB03_N, HB1.HB03_P, HB1.HB04_N, HB1.HB04_P, HB1.HB05_N, HB1.HB05_P, HB1.HB06_CC_N, HB1.HB06_CC_P, HB1.HB07_N, HB1.HB07_P, HB1.HB08_N, HB1.HB08_P, HB1.HB09_N, HB1.HB09_P, HB1.HB10_N, HB1.HB10_P, HB1.HB11_N, HB1.HB11_P, HB1.HB12_N, HB1.HB12_P, HB1.HB13_N, HB1.HB13_P, HB1.HB14_N, HB1.HB14_P, HB1.HB15_N, HB1.HB15_P, HB1.HB16_N, HB1.HB16_P, HB1.HB17_CC_N, HB1.HB17_CC_P, HB1.HB18_N, HB1.HB18_P, HB1.HB19_N, HB1.HB19_P, HB1.HB20_N, HB1.HB20_P, HB1.HB21_N, HB1.HB21_P, LA1.LA00_CC_N, LA1.LA00_CC_P, LA1.LA01_CC_N, LA1.LA01_CC_P, LA1.LA02_N, LA1.LA02_P, LA1.LA03_N, LA1.LA03_P, LA1.LA04_N, LA1.LA04_P, LA1.LA05_N, LA1.LA05_P, LA1.LA06_N, LA1.LA06_P, LA1.LA07_N, LA1.LA07_P, LA1.LA08_N, LA1.LA08_P, LA1.LA09_N, LA1.LA09_P, LA1.LA10_N, LA1.LA10_P, LA1.LA11_N, LA1.LA11_P, LA1.LA12_N, LA1.LA12_P, LA1.LA13_N, LA1.LA13_P, LA1.LA14_N, LA1.LA14_P, LA1.LA15_N, LA1.LA15_P, LA1.LA16_N, LA1.LA16_P, LA1.LA17_CC_N, LA1.LA17_CC_P, LA1.LA18_CC_N, LA1.LA18_CC_P, LA1.LA19_N, LA1.LA19_P, LA1.LA20_N, LA1.LA20_P, LA1.LA21_N, LA1.LA21_P, LA1.LA22_N, LA1.LA22_P, LA1.LA23_N, LA1.LA23_P, LA1.LA24_N, LA1.LA24_P, LA1.LA25_N, LA1.LA25_P, LA1.LA26_N, LA1.LA26_P, LA1.LA27_N, LA1.LA27_P, LA1.LA28_N, LA1.LA28_P, LA1.LA29_N, LA1.LA29_P, LA1.LA30_N, LA1.LA30_P, LA1.LA31_N, LA1.LA31_P, LA1.LA32_N, LA1.LA32_P, LA1.LA33_N, LA1.LA33_P

### Notes on the sheet
- DP8_M2C_P
- DP9_M2C_P
- DP9_M2C_N
- DP7_M2C_P
- DP7_M2C_N
- DP8_M2C_N
- DP4_M2C_P
- DP4_M2C_N
- DP5_M2C_P
- DP6_M2C_P
- DP6_M2C_N
- DP5_M2C_N
- DP8_C2M_P
- DP9_C2M_P
- DP9_C2M_N
- DP7_C2M_P
- DP7_C2M_N
- DP8_C2M_N
- DP4_C2M_P
- DP4_C2M_N
- DP5_C2M_P
- DP6_C2M_P
- DP6_C2M_N
- DP5_C2M_N
- RES0
- VIO_B_M2C
- VAdj is not defined as power supply and therefore as global signal as it might differ for the 2 FMC mezzanines.
- Project/Equipment
- Document
- Designer
- Drawn by
- Check.by
- Last Mod.
- Copyright CNPEM 2013, WUT ISE 2020
  This documentation describes Open Hardware and is licensed under CERN OHL v.1.1. You may redistribute and modify this documentaction under the terms of the CERN OHL v1.1.
  (http://ohwr.org/CERNOHL). This documentation is dristributed WITHOUT ANY EXPRESS OR IMPLIED WARRANTY, INCLUDING OF MERCHANTABLITY, SATISFACTORY QUALITY AND FITNESS FOR A PARTICULAR PURPOSE. Please see the CERN OHL v.1.1 for applicable conditions
- Contact:
- File
- Print Date
- Sheet
- Size
- A2
- of
- Rev

### Library data of the parts
B1-B4 = PLATED_HOLE2.7_PAD5.0: Single Terminal Socket; Part Description: Plated Through Hole: Hole Dia.=2.7mm Pad Dia.=5.0mm; Mounted: No; Table: Pads; Part Number: PLATED_HOLE2.7_PAD5.0; Component Type: Standard (No BOM); Pin Count: 1; Family: Plated Hole; Socket: No; SMD: No; Status: None; ComponentHeight: 0mm; Author: CERN DEM JMW; CreateDate: 2011-09-27; LatestRevisionDate: 2011-09-27; PackageDescription: Plated Through Hole: Hole Dia.=2.7mm Pad Dia.=5.0mm
C1 C5 C7 = CC1206_22UF_10V_10%_X7R: Non-polarised capacitor; Part Description: SMD Multilayer Chip Ceramic Capacitor; Manufacturer: GENERIC; Manufacturer1 Part Number: GRM31CR71A226KE15L; Voltage: 10V; TC: X7R; Tolerance: ±10%; Table: Capacitors SMD; Part Number: CC1206_22UF_10V_10%_X7R; Component Kind: Standard; Component Type: Standard; Pin Count: 2; Value: 22uF; Status: Preferred; Manufacturer Part Number: CC1206_22UF_10V_10%_X7R; Case: 1206; Mounted: Yes; Socket: No; SMD: Yes; Manufacturer1 Example: MURATA; Manufacturer1 ComponentHeight: 1.8mm; HelpURL: \\cern.ch\dfs\Applications\Altium\Datasheets\CC1206_X7R_MURATA_GRM-HI-CAP.pdf; Author: CERN DEM JLC; CreateDate: 2010-06-08; LatestRevisionDate: 2010-06-08
C2 C3 C8 C9 C13 C14 C16 C17 = CC0603_1UF_16V_10%_X7R: Non-polarised capacitor; Part Description: SMD Multilayer Chip Ceramic Capacitor; Manufacturer: GENERIC; Manufacturer1 Part Number: 223824613663; Voltage: 16V; TC: X7R; Tolerance: ±10%; Table: Capacitors SMD; Part Number: CC0603_1UF_16V_10%_X7R; Component Kind: Standard; Component Type: Standard; Pin Count: 2; Value: 1uF; Status: Preferred; Manufacturer Part Number: CC0603_1uF_16V_10%_X7R; Case: 0603; Mounted: Yes; Socket: No; SMD: Yes; Manufacturer1 Example: PHYCOMP; Manufacturer1 ComponentHeight: 0.87mm; HelpURL: \\cern.ch\dfs\Applications\Altium\Datasheets\CC0805_X5R_PHYCOMP_HC.pdf; Author: CERN DEM JLC; CreateDate: 2007-12-03; LatestRevisionDate: 2007-12-03
C4 C6 C10 C11 C15 = CC0201_100NF_6.3V_10%_X5R: Non-polarised capacitor; Part Description: SMD Multilayer Chip Ceramic Capacitor; Manufacturer: GENERIC; Manufacturer1 Part Number: 02016D104KAT2A; Voltage: 6.3V; TC: X5R; Tolerance: ±10%; Table: Capacitors SMD; Part Number: CC0201_100NF_6.3V_10%_X5R; Component Kind: Standard; Component Type: Standard; Pin Count: 2; Value: 100nF; Status: Not Recommended; Manufacturer Part Number: CC0201_100NF_6.3V_10%_X5R; Case: 0201; Mounted: Yes; Socket: No; SMD: Yes; Manufacturer1 Example: AVX; Manufacturer1 ComponentHeight: 0.33mm; HelpURL: \\cern.ch\dfs\Applications\Altium\Datasheets\CC0201_X5R_AVX.pdf; Author: CERN DEM JLC; CreateDate: 2007-12-03; LatestRevisionDate: 2007-12-03
C12 = CC0805_10UF_16V_10%_X5R: Non-polarised capacitor; Part Description: SMD Multilayer Chip Ceramic Capacitor; Manufacturer: GENERIC; Manufacturer1 Part Number: C0805C106K4PAC; Voltage: 16V; TC: X5R; Tolerance: ±10%; Table: Capacitors SMD; Part Number: CC0805_10UF_16V_10%_X5R; Component Kind: Standard; Component Type: Standard; Pin Count: 2; Value: 10uF; Status: Preferred; Manufacturer Part Number: CC0805_10UF_16V_10%_X5R; Case: 0805; Mounted: Yes; Socket: No; SMD: Yes; Manufacturer1 Example: KEMET; Manufacturer1 ComponentHeight: 1.4mm; HelpURL: \\cern.ch\dfs\Applications\Altium\Datasheets\CC1206_X5R_KEMET.pdf; Author: CERN DEM JLC; CreateDate: 2007-12-03; LatestRevisionDate: 2007-12-03
J15 = SAMTEC_ASP-134486-01: Connector VITA 57, 400 Female contacts in 10 row abcdefghj; Part Description: 400 contacts (10 rows abcdefghj) Surface Mount Female Connector, VITA 57; Manufacturer: SAMTEC; Part Number: SAMTEC_ASP-134486-01; Component Kind: Standard; Component Type: Standard; Pin Count: 400; Family: VITA 57; Mounted: Yes; Socket: No; SMD: Yes; Status: None; Manufacturer Part Number: ASP-134486-01; ComponentHeight: 6.55mm; HelpURL: \\cern.ch\dfs\Applications\Altium\Datasheets\SAMTEC_ASP-134486-01.pdf; Author: CERN DEM JLC; CreateDate: 30/04/2009; LatestRevisionDate: 17/08/2009; Table: SAMTEC